# EAGLE design ArbotixProv11 (EAGLE 7.2.0)

## Sheet 1 of 7: MAIN
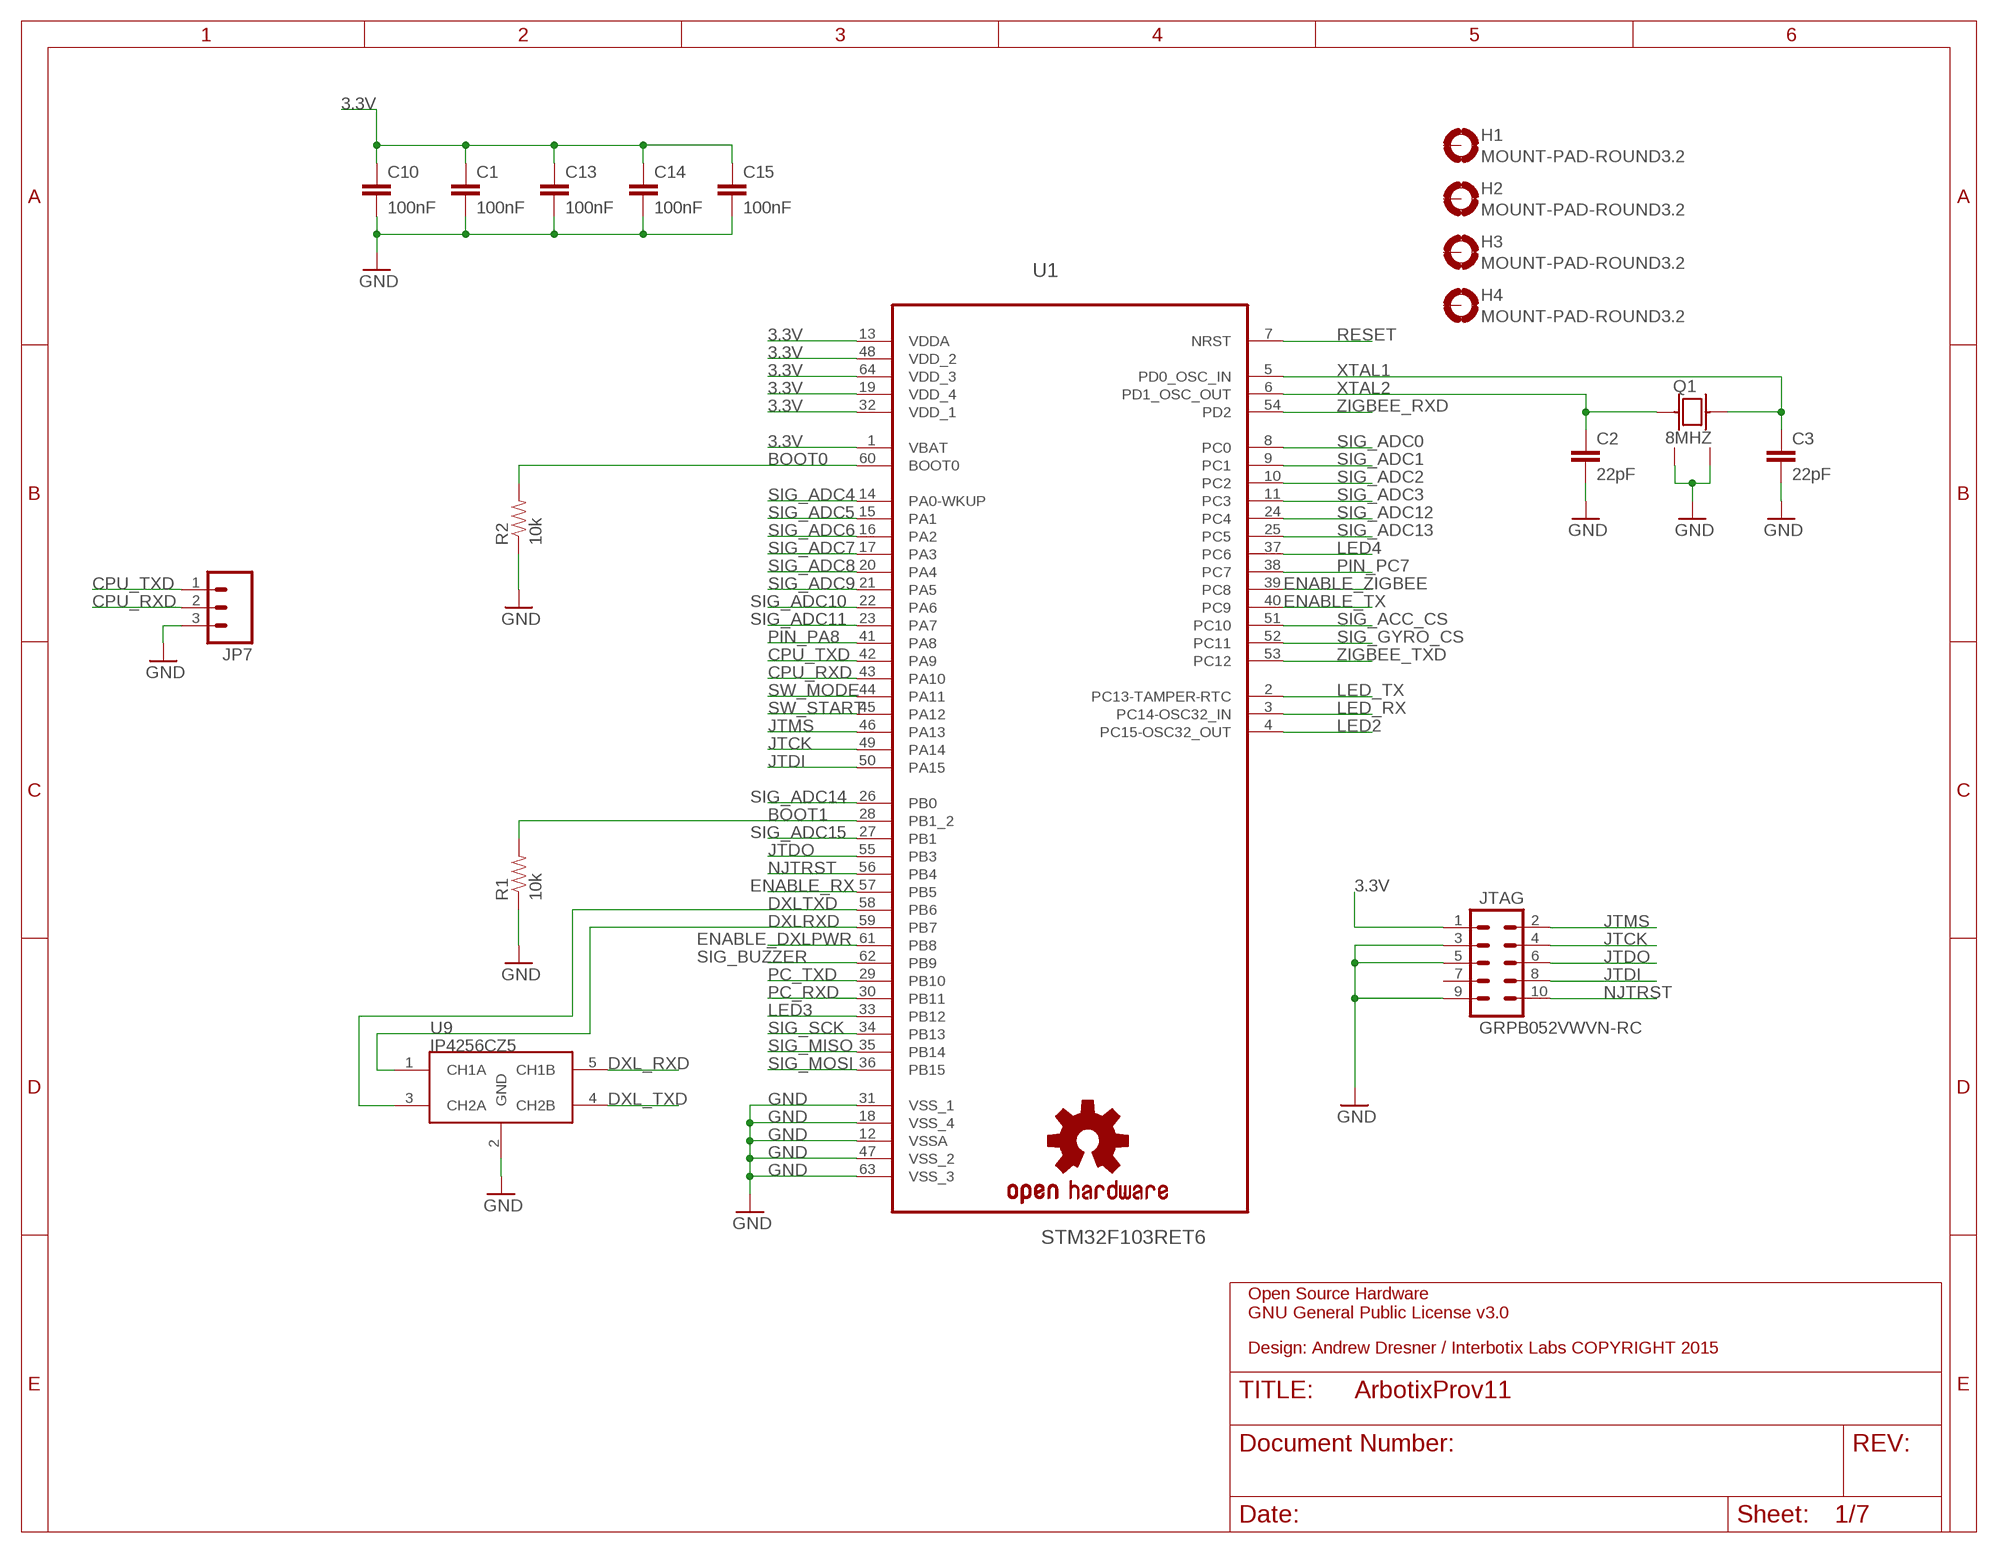
[diagram p0: schematic, sheet 1]

### Parts
C1  100nF  CAP0603-CAP  [0603-CAP]
C2  22pF  22PF-50V-5%(0603)  [0603-CAP]
C3  22pF  22PF-50V-5%(0603)  [0603-CAP]
C10  100nF  CAP0603-CAP  [0603-CAP]
C13  100nF  CAP0603-CAP  [0603-CAP]
C14  100nF  CAP0603-CAP  [0603-CAP]
C15  100nF  CAP0603-CAP  [0603-CAP]
H1  MOUNT-PAD-ROUND3.2  [3,2-PAD]
H2  MOUNT-PAD-ROUND3.2  [3,2-PAD]
H3  MOUNT-PAD-ROUND3.2  [3,2-PAD]
H4  MOUNT-PAD-ROUND3.2  [3,2-PAD]
JP7  M03PTH  [1X03]
JTAG  GRPB052VWVN-RC  M05X20.05_IN_PTH_SILK  [2X5_PTH_SILK_.05]
LOGO1  OSHW-LOGOM  [OSHW-LOGO-M]
Q1  8MHZ  AMB3B-25.000MHZ-B2-T8MHZ8MHZ  [4LCC]
R1  10k  RESISTOR0603-RES  [0603-RES]
R2  10k  RESISTOR0603-RES  [0603-RES]
U1  STM32F103RET6  [QFP50P1200X1200X160-64N]
U9  IP4256CZ5  IP4256CZ5-W,115  [SOT665]

### Nets
3.3V: C1.1 C10.1 C13.1 C14.1 C15.1 JTAG.1 U1.1(VBAT) U1.13(VDDA) U1.19(VDD_4) U1.32(VDD_1) U1.48(VDD_2) U1.64(VDD_3) ; also sheet 2,4,5,6,7
BOOT0: R2.2 U1.60(BOOT0)
BOOT1: R1.2 U1.28(PB1_2)
CPU_RXD: JP7.2 U1.43(PA10)
CPU_TXD: JP7.1 U1.42(PA9)
DXL_RXD: U9.5(CH1B) ; also sheet 3
DXL_TXD: U9.4(CH2B) ; also sheet 3
DXLRXD: U1.59(PB7) U9.1(CH1A)
DXLTXD: U1.58(PB6) U9.3(CH2A)
ENABLE_DXLPWR: U1.61(PB8) ; also sheet 3
ENABLE_RX: U1.57(PB5) ; also sheet 3
ENABLE_TX: U1.40(PC9) ; also sheet 3
ENABLE_ZIGBEE: U1.39(PC8) ; also sheet 7
GND: C1.2 C2.2 C3.2 C10.2 C13.2 C14.2 C15.2 JP7.3 JTAG.3 JTAG.5 JTAG.9 Q1.2(G$1) Q1.4(G$2) R1.1 R2.1 U1.12(VSSA) U1.18(VSS_4) U1.31(VSS_1) U1.47(VSS_2) U1.63(VSS_3) U9.2(GND) ; also sheet 2,3,4,5,6,7
JTCK: JTAG.4 U1.49(PA14)
JTDI: JTAG.8 U1.50(PA15)
JTDO: JTAG.6 U1.55(PB3)
JTMS: JTAG.2 U1.46(PA13)
LED2: U1.4(PC15-OSC32_OUT) ; also sheet 6
LED3: U1.33(PB12) ; also sheet 6
LED4: U1.37(PC6) ; also sheet 6
LED_RX: U1.3(PC14-OSC32_IN) ; also sheet 6
LED_TX: U1.2(PC13-TAMPER-RTC) ; also sheet 6
NJTRST: JTAG.10 U1.56(PB4)
PC_RXD: U1.30(PB11) ; also sheet 4
PC_TXD: U1.29(PB10) ; also sheet 4
PIN_PA8: U1.41(PA8) ; also sheet 6
PIN_PC7: U1.38(PC7)
RESET: U1.7(NRST) ; also sheet 6
SIG_ACC_CS: U1.51(PC10) ; also sheet 5
SIG_ADC0: U1.8(PC0) ; also sheet 6
SIG_ADC1: U1.9(PC1) ; also sheet 6
SIG_ADC2: U1.10(PC2) ; also sheet 6
SIG_ADC3: U1.11(PC3) ; also sheet 6
SIG_ADC4: U1.14(PA0-WKUP) ; also sheet 6
SIG_ADC5: U1.15(PA1) ; also sheet 6
SIG_ADC6: U1.16(PA2) ; also sheet 6
SIG_ADC7: U1.17(PA3) ; also sheet 6
SIG_ADC8: U1.20(PA4) ; also sheet 6
SIG_ADC9: U1.21(PA5) ; also sheet 6
SIG_ADC10: U1.22(PA6) ; also sheet 6
SIG_ADC11: U1.23(PA7) ; also sheet 6
SIG_ADC12: U1.24(PC4) ; also sheet 6
SIG_ADC13: U1.25(PC5) ; also sheet 6
SIG_ADC14: U1.26(PB0) ; also sheet 6
SIG_ADC15: U1.27(PB1) ; also sheet 6
SIG_BUZZER: U1.62(PB9) ; also sheet 6
SIG_GYRO_CS: U1.52(PC11) ; also sheet 5
SIG_MISO: U1.35(PB14) ; also sheet 5
SIG_MOSI: U1.36(PB15) ; also sheet 5
SIG_SCK: U1.34(PB13) ; also sheet 5
SW_MODE: U1.44(PA11) ; also sheet 6
SW_START: U1.45(PA12) ; also sheet 6
XTAL1: C3.1 Q1.3 U1.5(PD0_OSC_IN)
XTAL2: C2.1 Q1.1 U1.6(PD1_OSC_OUT)
ZIGBEE_RXD: U1.54(PD2) ; also sheet 7
ZIGBEE_TXD: U1.53(PC12) ; also sheet 7
Unconnected: H1.B3,2(MOUNT) H2.B3,2(MOUNT) H3.B3,2(MOUNT) H4.B3,2(MOUNT) JTAG.7

### Notes on the sheet
- Open Source Hardware
  GNU General Public License v3.0
- Design: Andrew Dresner / Interbotix Labs COPYRIGHT 2015

## Sheet 2 of 7: Power
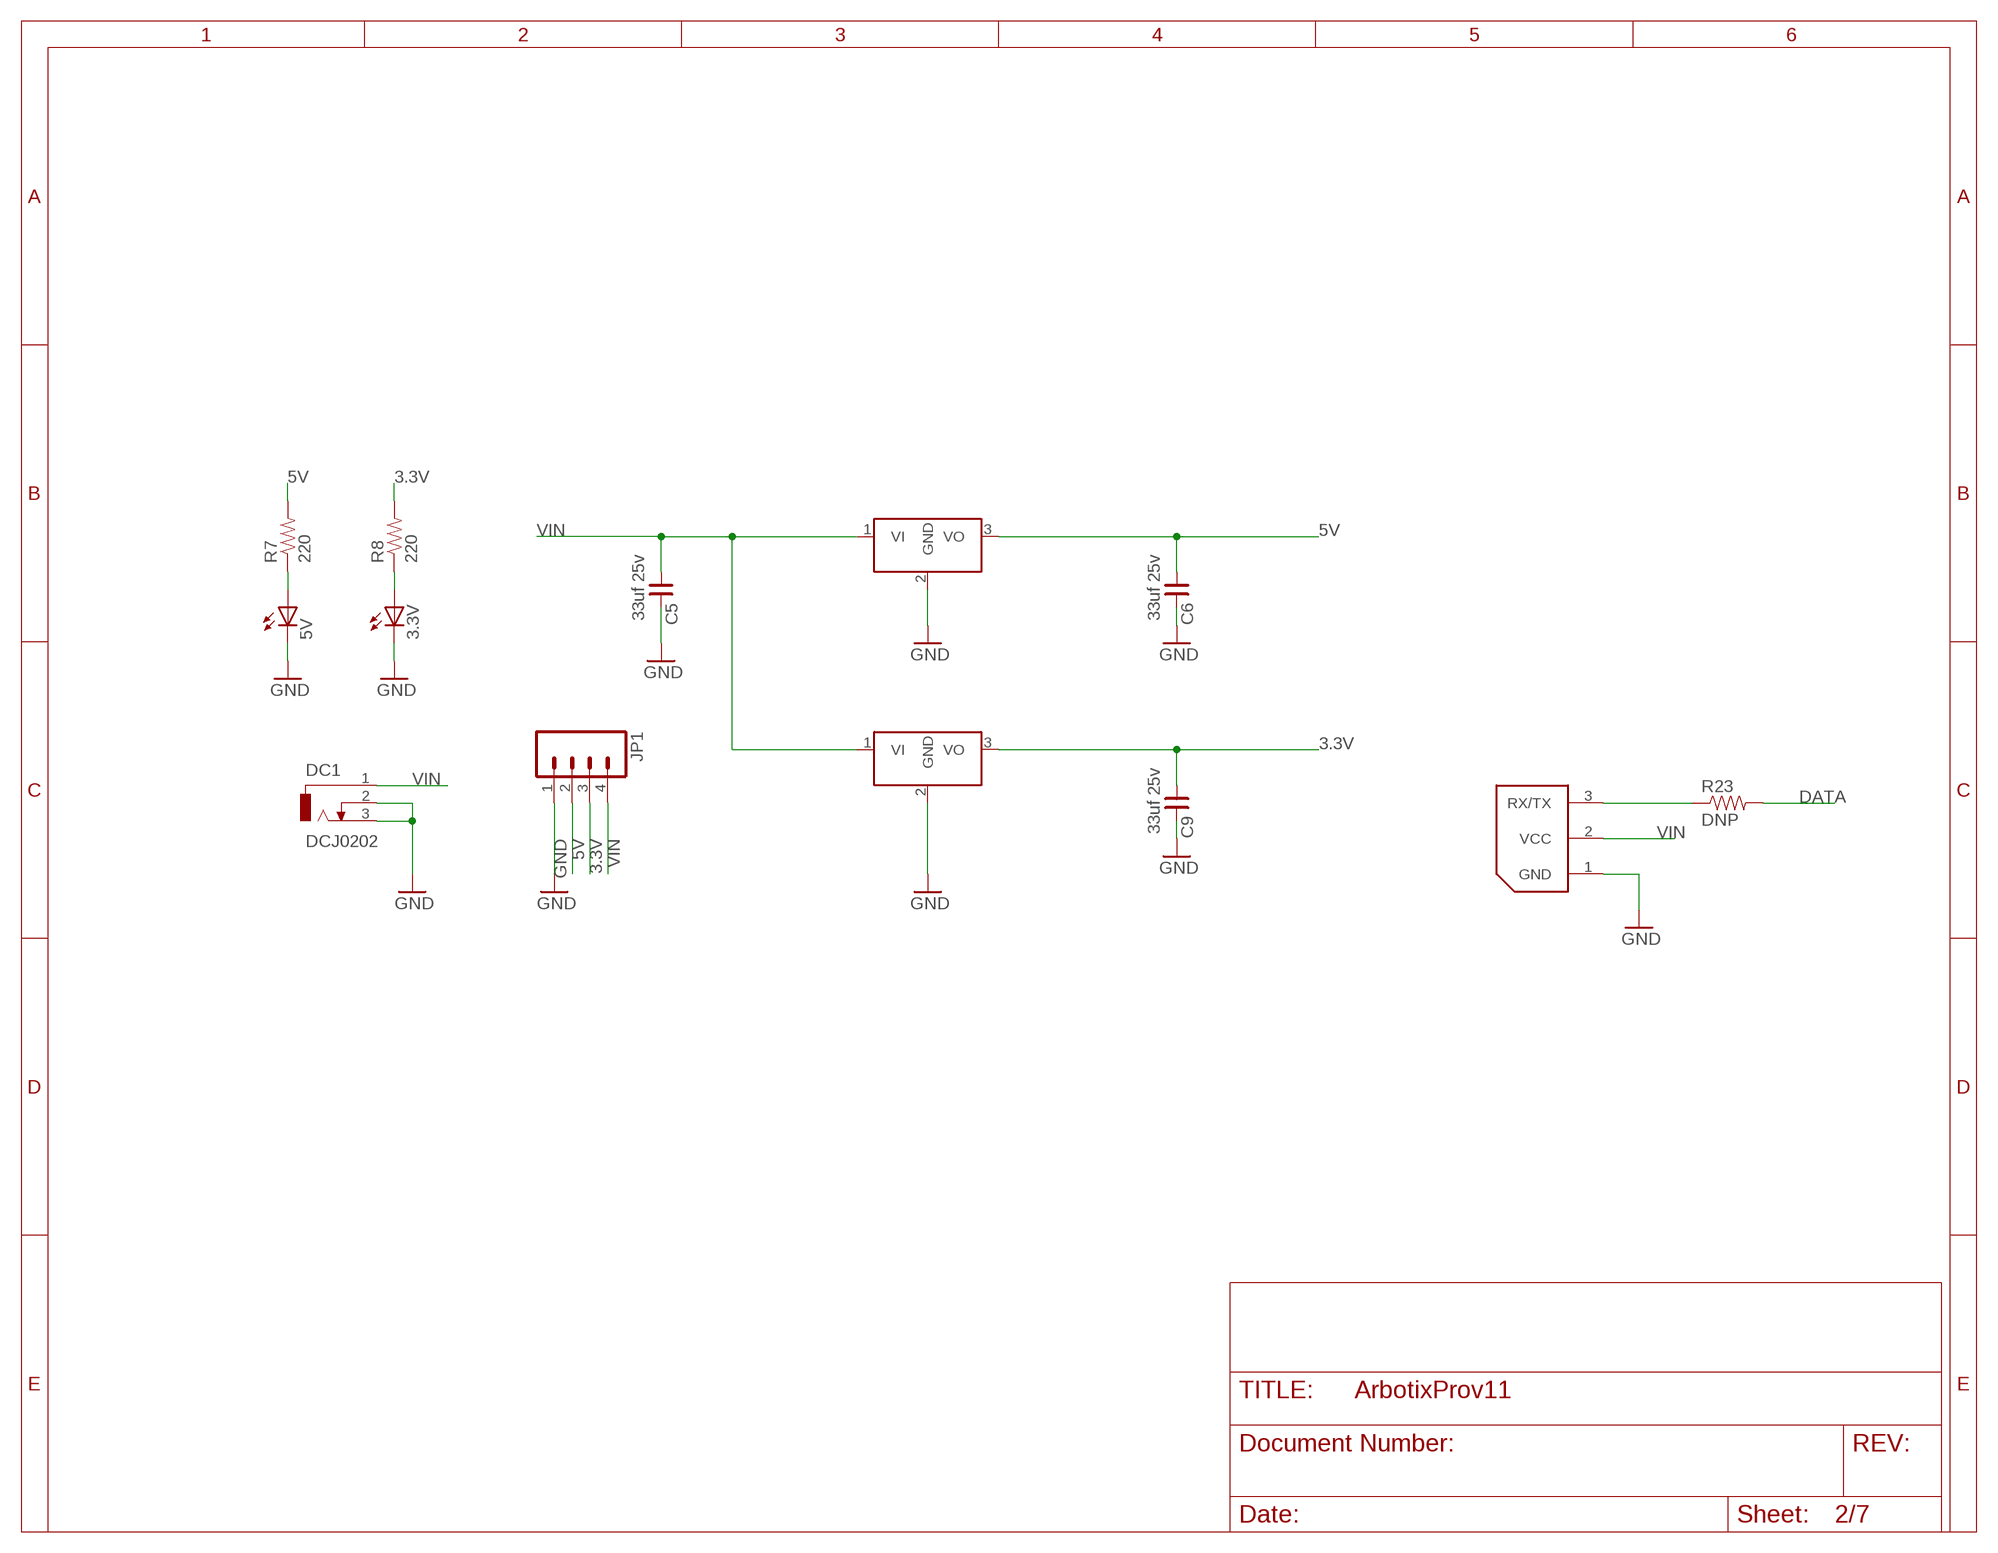
[diagram p1: schematic, sheet 2]

### Parts
3.3V  LEDCHIPLED_0603  [CHIPLED_0603]
3V3REG  DCDC_OKI-78SR-3.3  DCDC_OKI-78SR  [OKI-78SRH]
5V  LEDCHIPLED_0603  [CHIPLED_0603]
5VREG  DCDC_OKI-78SR-5  DCDC_OKI-78SR  [OKI-78SRH]
C5  33uf 25v  CBP-SV-C  [SV-C]
C6  33uf 25v  CBP-SV-C  [SV-C]
C9  33uf 25v  CBP-SV-C  [SV-C]
CPU-POWER  WM18887-ND  [BIOLOID]
DC1  DCJ0202  [DCJ0202]
JP1  M04PTH  [1X04]
R7  220  RESISTOR0603  [0603-RES]
R8  220  RESISTOR0603  [0603-RES]
R23  DNP  RESISTOR0603  [0603-RES]

### Nets
3.3V: 3V3REG.3(VO) C9.+ JP1.3 R8.2 ; also sheet 1,4,5,6,7
5V: 5VREG.3(VO) C6.+ JP1.2 R7.2 ; also sheet 3,6
DATA: R23.2 ; also sheet 3
GND: 3.3V.C 3V3REG.2(GND) 5V.C 5VREG.2(GND) C5.- C6.- C9.- CPU-POWER.1(GND) DC1.2 DC1.3 JP1.1 ; also sheet 1,3,4,5,6,7
N$9: CPU-POWER.3(RX/TX) R23.1
N$12: 5V.A R7.1
N$14: 3.3V.A R8.1
VIN: 3V3REG.1(VI) 5VREG.1(VI) C5.+ CPU-POWER.2(VCC) DC1.1 JP1.4 ; also sheet 3,6

## Sheet 3 of 7: DXL BUS
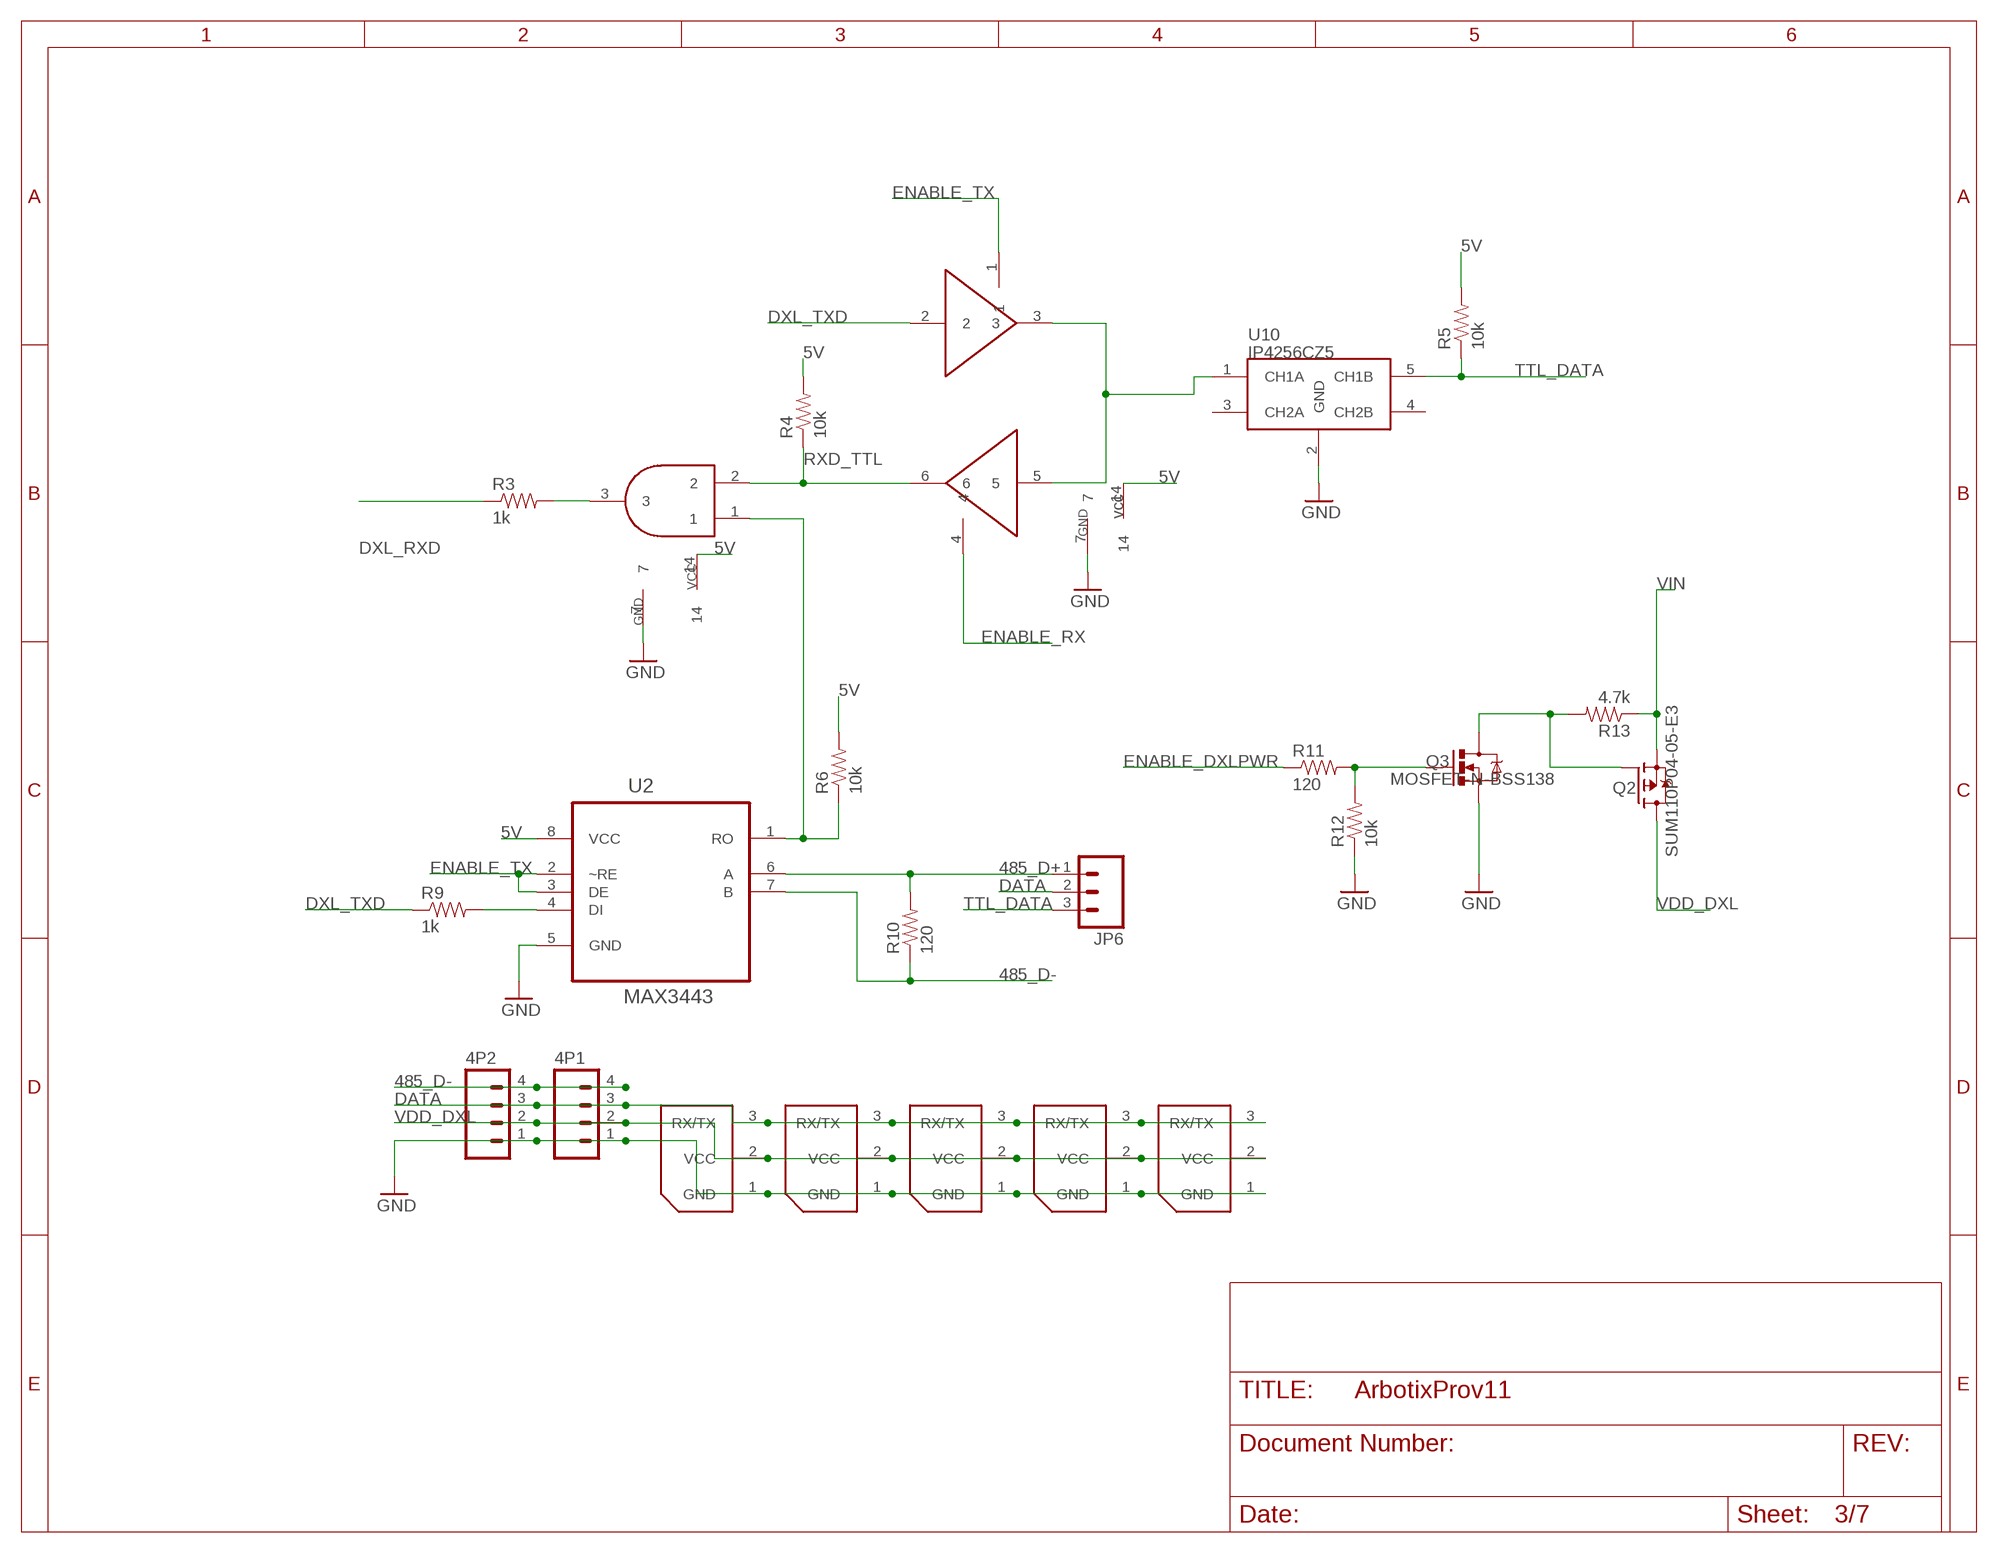
[diagram p2: schematic, sheet 3]

### Parts
3P1  WM18887-ND  [BIOLOID]
3P2  WM18887-ND  [BIOLOID]
3P3  WM18887-ND  [BIOLOID]
3P4  WM18887-ND  [BIOLOID]
3P5  WM18887-ND  [BIOLOID]
4P1  M04PTH  [1X04]
4P2  M04PTH  [1X04]
JP6  M03PTH  [1X03]
Q2  SUM110P04-05-E3  SPB80P06P  [TO263]
Q3  MOSFET-N-BSS138  MOSFET-NCHANNELBSS138  [SOT23]
R3  1k  RESISTOR0603-RES  [0603-RES]
R4  10k  RESISTOR0603-RES  [0603-RES]
R5  10k  RESISTOR0603-RES  [0603-RES]
R6  10k  RESISTOR0603-RES  [0603-RES]
R9  1k  RESISTOR0603-RES  [0603-RES]
R10  120  RESISTOR0603-RES  [0603-RES]
R11  120  RESISTOR0603-RES  [0603-RES]
R12  10k  RESISTOR0603-RES  [0603-RES]
R13  4.7k  RESISTOR0603-RES  [0603-RES]
U2  MAX3443  MAX3443EESA+  [SOIC127P600X175-8N]
U6  74HC08D,653  74HCT08D,653  [14-SOIC]
U7  74HC126D,653  [14-SOIC]
U10  IP4256CZ5  IP4256CZ5-W,115  [SOT665]

### Nets
5V: R4.2 R5.2 R6.2 U2.8(VCC) U6.14 U7.14 ; also sheet 2,6
485_D+: JP6.1 R10.2 U2.6(A)
485_D-: 4P1.4 4P2.4 R10.1 U2.7(B)
DATA: 3P1.3(RX/TX) 3P2.3(RX/TX) 3P3.3(RX/TX) 3P4.3(RX/TX) 3P5.3(RX/TX) 4P1.3 4P2.3 JP6.2 ; also sheet 2
DXL_RXD: R3.1 ; also sheet 1
DXL_TXD: R9.1 U7.2 ; also sheet 1
ENABLE_DXLPWR: R11.1 ; also sheet 1
ENABLE_RX: U7.4 ; also sheet 1
ENABLE_TX: U2.2(~RE) U2.3(DE) U7.1 ; also sheet 1
GND: 3P1.1(GND) 3P2.1(GND) 3P3.1(GND) 3P4.1(GND) 3P5.1(GND) 4P1.1 4P2.1 Q3.2(S) R12.1 U2.5(GND) U6.7 U7.7 U10.2(GND) ; also sheet 1,2,4,5,6,7
N$1: Q3.1(G) R11.2 R12.2
N$5: R3.2 U6.3
N$6: R9.2 U2.4(DI)
N$7: R6.1 U2.1(RO) U6.1
N$15: Q2.1(G) Q3.3(D) R13.2
N$17: U7.3 U7.5 U10.1(CH1A)
RXD_TTL: R4.1 U6.2 U7.6
TTL_DATA: JP6.3 R5.1 U10.5(CH1B)
VDD_DXL: 3P1.2(VCC) 3P2.2(VCC) 3P3.2(VCC) 3P4.2(VCC) 3P5.2(VCC) 4P1.2 4P2.2 Q2.3(D)
VIN: Q2.2(S) R13.1 ; also sheet 2,6
Unconnected: U10.3(CH2A) U10.4(CH2B)

## Sheet 4 of 7: USB-FTDI-TERMINAL
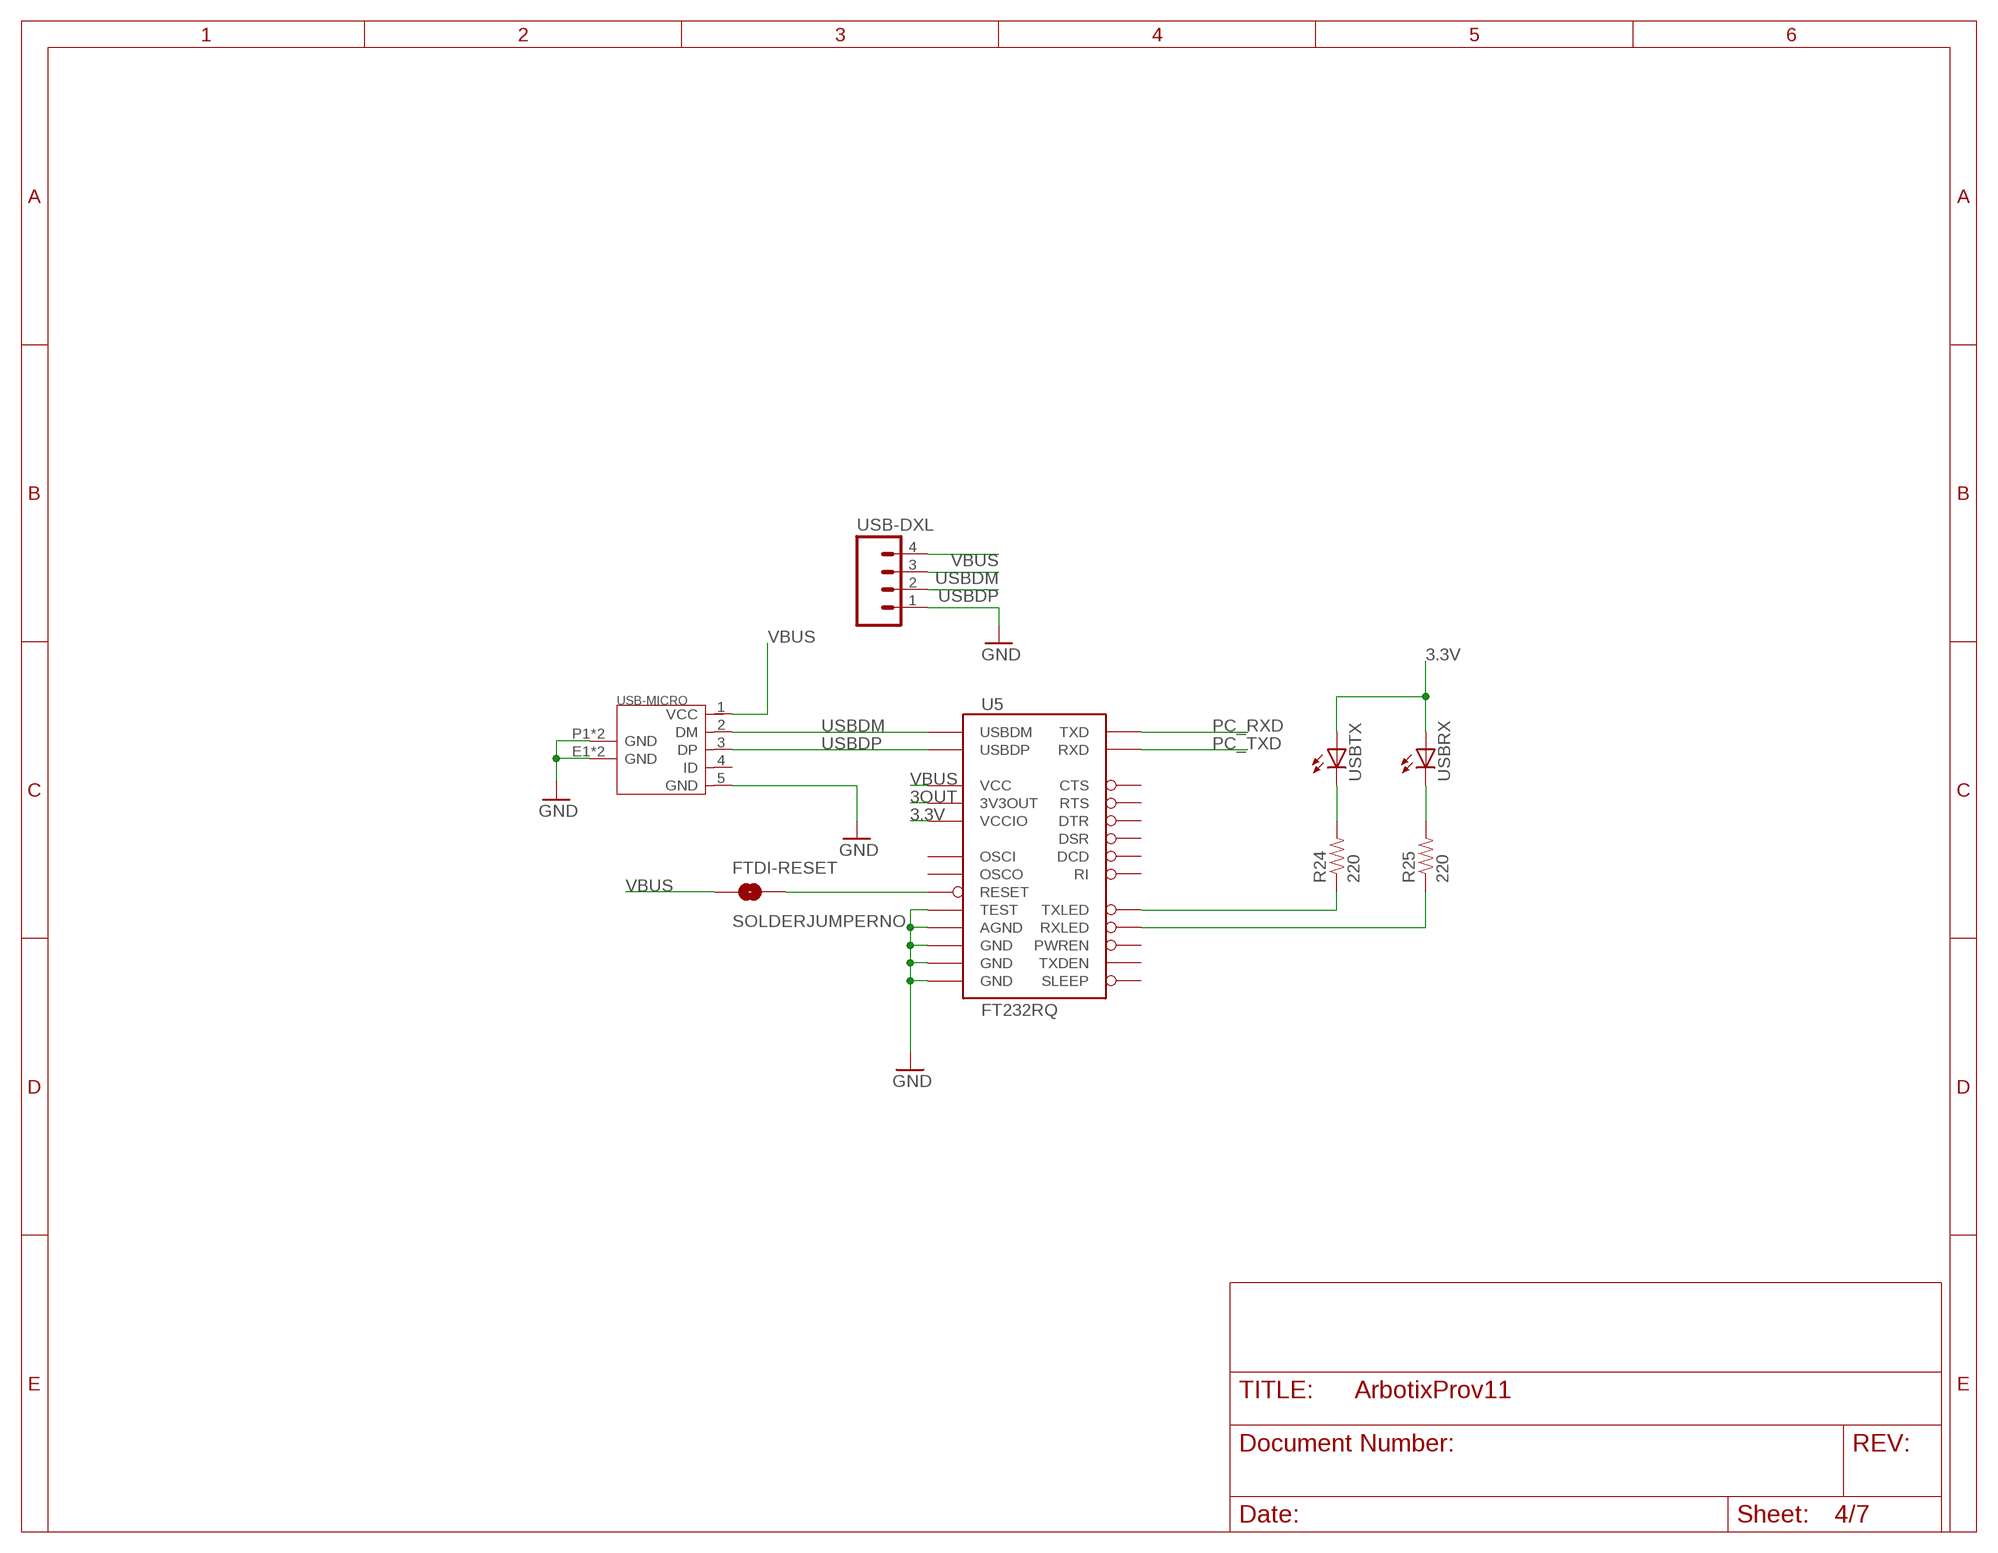
[diagram p3: schematic, sheet 4]

### Parts
FTDI-RESET  SOLDERJUMPERNO  [SJ_2S-NO]
R24  220  RESISTOR0603  [0603-RES]
R25  220  RESISTOR0603  [0603-RES]
U5  FT232RQ  [QFN-32]
USB-DXL  M04PTH  [1X04]
USB-MICRO  MICRO-USB-5P-340015001  [B-SMD-5P]
USBRX  LEDCHIPLED_0603  [CHIPLED_0603]
USBTX  LEDCHIPLED_0603  [CHIPLED_0603]

### Nets
3.3V: U5.1(VCCIO) USBRX.A USBTX.A ; also sheet 1,2,5,6,7
3OUT: U5.16(3V3OUT)
GND: U5.4(GND) U5.17(GND) U5.20(GND) U5.24(AGND) U5.26(TEST) USB-DXL.1 USB-MICRO.5(GND) USB-MICRO.E1(GND) USB-MICRO.E2(GND) USB-MICRO.P1(GND) USB-MICRO.P2(GND) ; also sheet 1,2,3,5,6,7
N$3: FTDI-RESET.2 U5.18(RESET)
N$19: R24.2 USBTX.C
N$22: R25.2 USBRX.C
N$24: R24.1 U5.22(TXLED)
N$25: R25.1 U5.21(RXLED)
PC_RXD: U5.30(TXD) ; also sheet 1
PC_TXD: U5.2(RXD) ; also sheet 1
USBDM: U5.15(USBDM) USB-DXL.3 USB-MICRO.2(DM)
USBDP: U5.14(USBDP) USB-DXL.2 USB-MICRO.3(DP)
VBUS: FTDI-RESET.1 U5.19(VCC) USB-DXL.4 USB-MICRO.1(VCC)
Unconnected: U5.3(RI) U5.6(DSR) U5.7(DCD) U5.8(CTS) U5.9(SLEEP) U5.10(TXDEN) U5.11(PWREN) U5.27(OSCI) U5.28(OSCO) U5.31(DTR) U5.32(RTS) USB-MICRO.4(ID)

## Sheet 5 of 7: ACC/GYRO
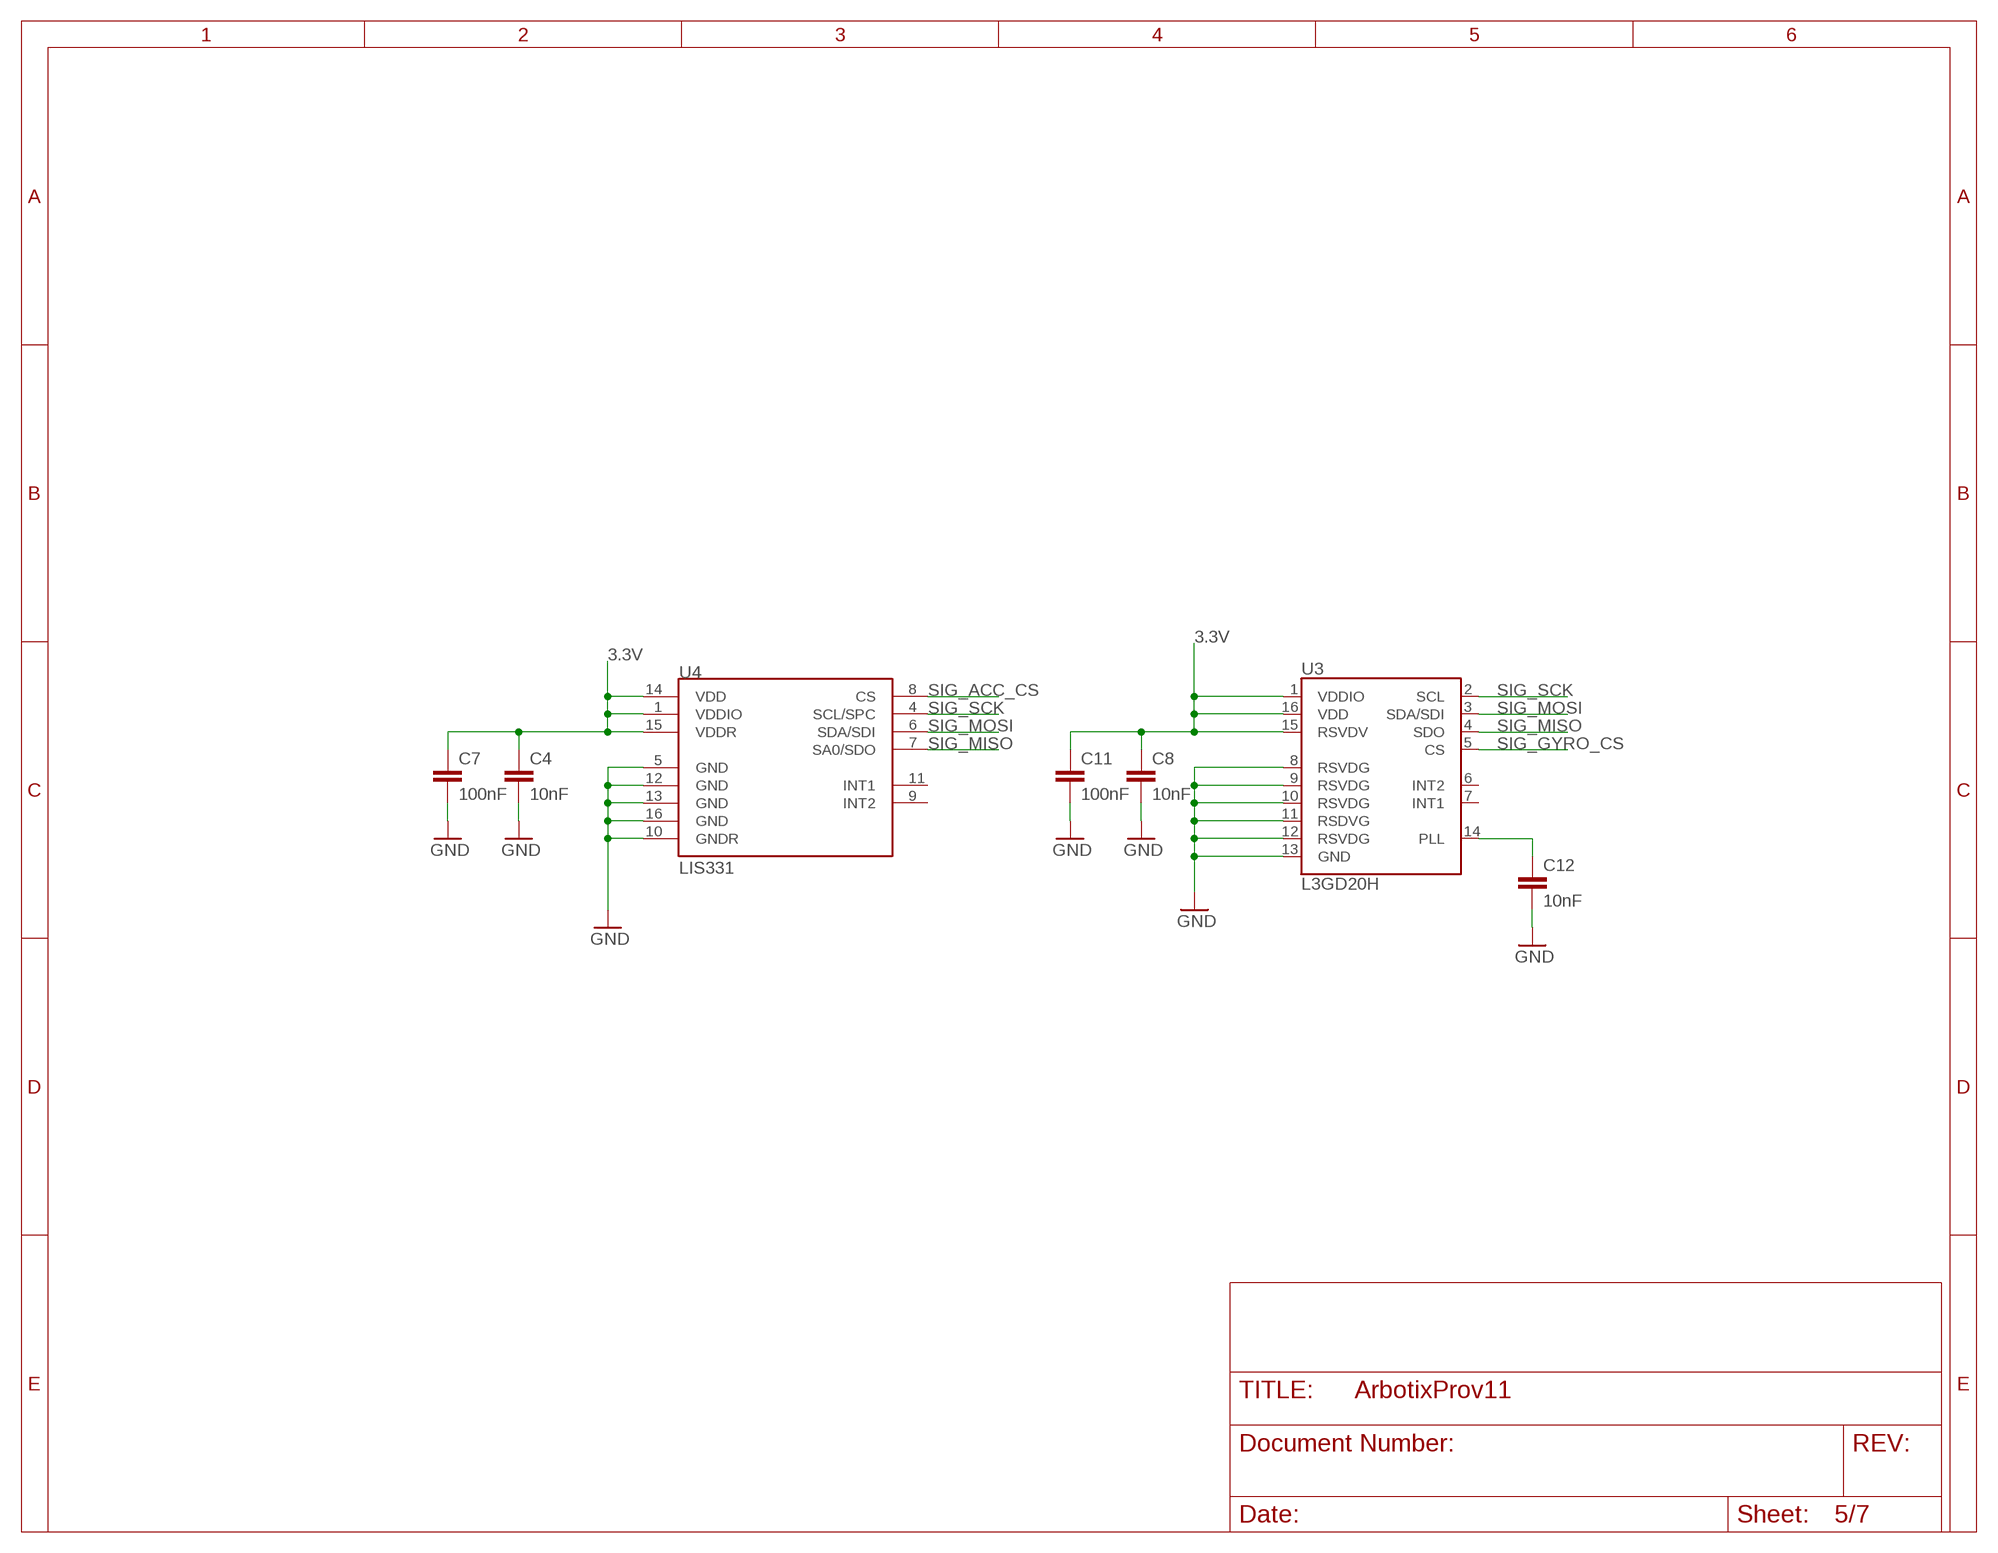
[diagram p4: schematic, sheet 5]

### Parts
C4  10nF  CAP0603-CAP  [0603-CAP]
C7  100nF  CAP0603-CAP  [0603-CAP]
C8  10nF  CAP0603-CAP  [0603-CAP]
C11  100nF  CAP0603-CAP  [0603-CAP]
C12  10nF  CAP0603-CAP  [0603-CAP]
U3  L3GD20H  [LGA16-3MM]
U4  LIS331  [LGA16-3MM]

### Nets
3.3V: C4.1 C7.1 C8.1 C11.1 U3.1(VDDIO) U3.15(RSVDV) U3.16(VDD) U4.1(VDDIO) U4.14(VDD) U4.15(VDDR) ; also sheet 1,2,4,6,7
GND: C4.2 C7.2 C8.2 C11.2 C12.2 U3.8(RSVDG) U3.9(RSVDG) U3.10(RSVDG) U3.11(RSDVG) U3.12(RSVDG) U3.13(GND) U4.5(GND) U4.10(GNDR) U4.12(GND) U4.13(GND) U4.16(GND) ; also sheet 1,2,3,4,6,7
N$2: C12.1 U3.14(PLL)
SIG_ACC_CS: U4.8(CS) ; also sheet 1
SIG_GYRO_CS: U3.5(CS) ; also sheet 1
SIG_MISO: U3.4(SDO) U4.7(SA0/SDO) ; also sheet 1
SIG_MOSI: U3.3(SDA/SDI) U4.6(SDA/SDI) ; also sheet 1
SIG_SCK: U3.2(SCL) U4.4(SCL/SPC) ; also sheet 1
Unconnected: U3.6(INT2) U3.7(INT1) U4.9(INT2) U4.11(INT1)

## Sheet 6 of 7: IO
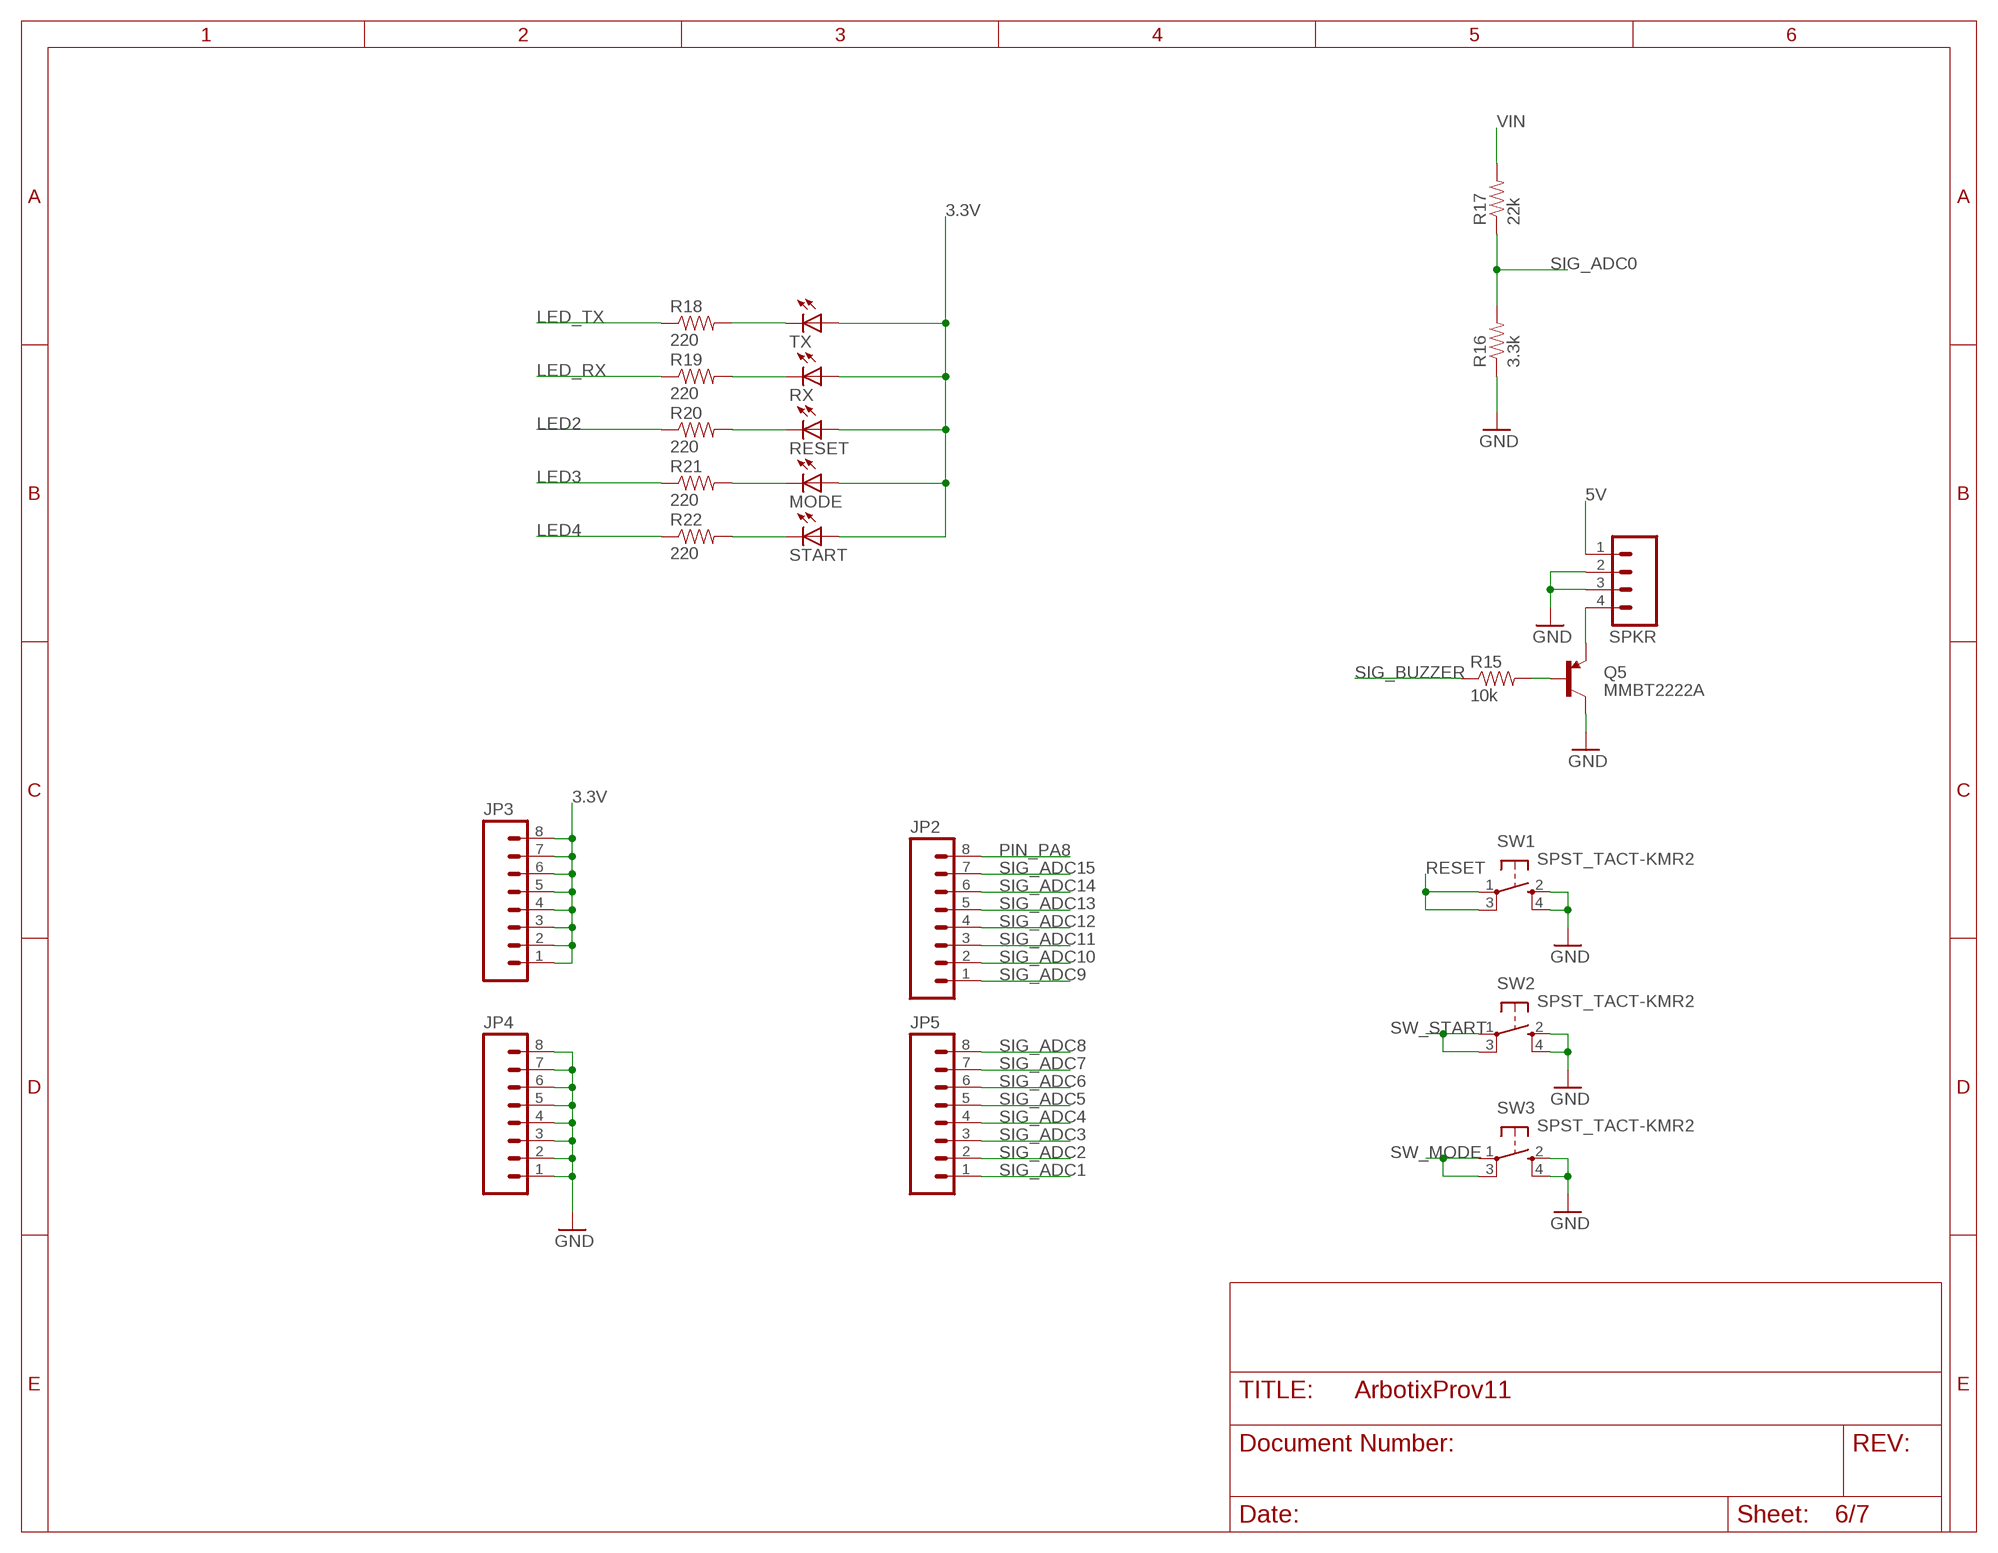
[diagram p5: schematic, sheet 6]

### Parts
JP2  M08SILK_FEMALE_PTH  [1X08]
JP3  M08SILK_FEMALE_PTH  [1X08]
JP4  M08SILK_FEMALE_PTH  [1X08]
JP5  M08SILK_FEMALE_PTH  [1X08]
MODE  LEDCHIP-LED0603  [CHIP-LED0603]
Q5  MMBT2222A  TRANSISTOR_PNPMMBT4403  [SOT23]
R15  10k  RESISTOR0603-RES  [0603-RES]
R16  3.3k  RESISTOR0603-RES  [0603-RES]
R17  22k  RESISTOR0603-RES  [0603-RES]
R18  220  RESISTOR0603-RES  [0603-RES]
R19  220  RESISTOR0603-RES  [0603-RES]
R20  220  RESISTOR0603-RES  [0603-RES]
R21  220  RESISTOR0603-RES  [0603-RES]
R22  220  RESISTOR0603-RES  [0603-RES]
RESET  LEDCHIP-LED0603  [CHIP-LED0603]
RX  LEDCHIP-LED0603  [CHIP-LED0603]
SPKR  M04PTH  [1X04]
START  LEDCHIP-LED0603  [CHIP-LED0603]
SW1  SPST_TACT-KMR2  [KMR2]
SW2  SPST_TACT-KMR2  [KMR2]
SW3  SPST_TACT-KMR2  [KMR2]
TX  LEDCHIP-LED0603  [CHIP-LED0603]

### Nets
3.3V: JP3.1 JP3.2 JP3.3 JP3.4 JP3.5 JP3.6 JP3.7 JP3.8 MODE.A RESET.A RX.A START.A TX.A ; also sheet 1,2,4,5,7
5V: SPKR.1 ; also sheet 2,3
GND: JP4.1 JP4.2 JP4.3 JP4.4 JP4.5 JP4.6 JP4.7 JP4.8 Q5.3(C) R16.1 SPKR.2 SPKR.3 SW1.2(S) SW1.4(S1) SW2.2(S) SW2.4(S1) SW3.2(S) SW3.4(S1) ; also sheet 1,2,3,4,5,7
LED2: R20.1 ; also sheet 1
LED3: R21.1 ; also sheet 1
LED4: R22.1 ; also sheet 1
LED_RX: R19.1 ; also sheet 1
LED_TX: R18.1 ; also sheet 1
N$8: R18.2 TX.C
N$11: R19.2 RX.C
N$13: Q5.1(B) R15.2
N$16: Q5.2(E) SPKR.4
N$20: R20.2 RESET.C
N$21: MODE.C R21.2
N$23: R22.2 START.C
PIN_PA8: JP2.8 ; also sheet 1
RESET: SW1.1(P) SW1.3(P1) ; also sheet 1
SIG_ADC0: R16.2 R17.1 ; also sheet 1
SIG_ADC1: JP5.1 ; also sheet 1
SIG_ADC2: JP5.2 ; also sheet 1
SIG_ADC3: JP5.3 ; also sheet 1
SIG_ADC4: JP5.4 ; also sheet 1
SIG_ADC5: JP5.5 ; also sheet 1
SIG_ADC6: JP5.6 ; also sheet 1
SIG_ADC7: JP5.7 ; also sheet 1
SIG_ADC8: JP5.8 ; also sheet 1
SIG_ADC9: JP2.1 ; also sheet 1
SIG_ADC10: JP2.2 ; also sheet 1
SIG_ADC11: JP2.3 ; also sheet 1
SIG_ADC12: JP2.4 ; also sheet 1
SIG_ADC13: JP2.5 ; also sheet 1
SIG_ADC14: JP2.6 ; also sheet 1
SIG_ADC15: JP2.7 ; also sheet 1
SIG_BUZZER: R15.1 ; also sheet 1
SW_MODE: SW3.1(P) SW3.3(P1) ; also sheet 1
SW_START: SW2.1(P) SW2.3(P1) ; also sheet 1
VIN: R17.2 ; also sheet 2,3

## Sheet 7 of 7: Wireless
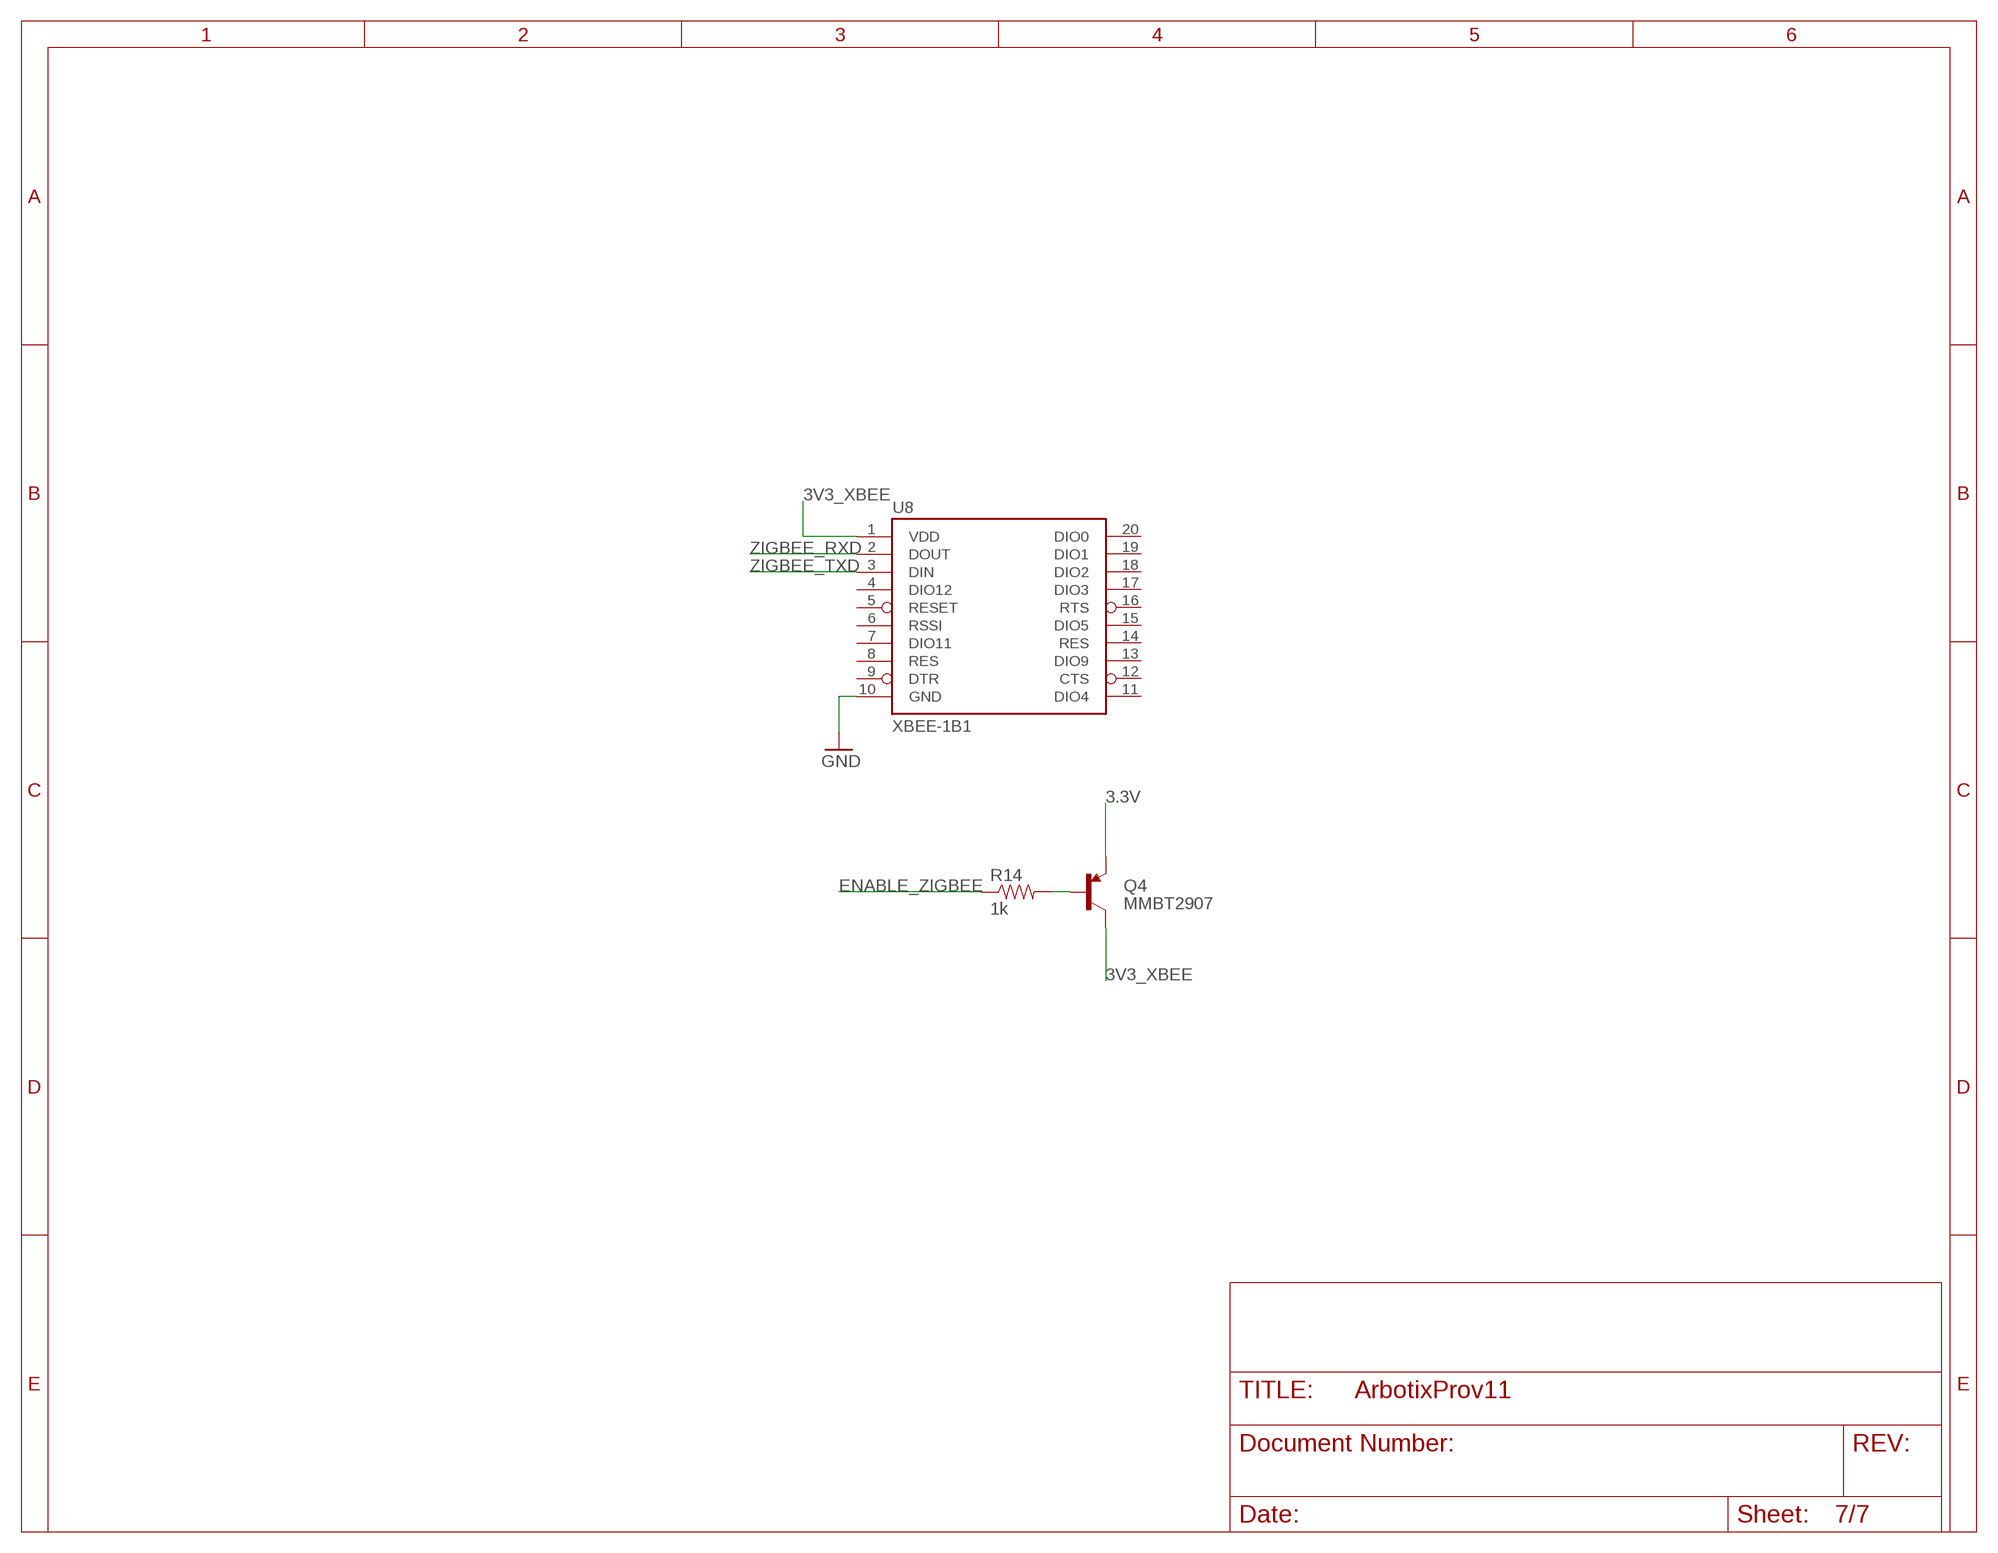
[diagram p6: schematic, sheet 7]

### Parts
Q4  MMBT2907  TRANSISTOR_PNPMMBT4403  [SOT23]
R14  1k  RESISTOR0603-RES  [0603-RES]
U8  XBEE-1B1  [XBEE-1]

### Nets
3.3V: Q4.2(E) ; also sheet 1,2,4,5,6
3V3_XBEE: Q4.3(C) U8.1(VDD)
ENABLE_ZIGBEE: R14.1 ; also sheet 1
GND: U8.10(GND) ; also sheet 1,2,3,4,5,6
N$18: Q4.1(B) R14.2
ZIGBEE_RXD: U8.2(DOUT) ; also sheet 1
ZIGBEE_TXD: U8.3(DIN) ; also sheet 1
Unconnected: U8.4(DIO12) U8.5(RESET) U8.6(RSSI) U8.7(DIO11) U8.8(RES) U8.9(DTR) U8.11(DIO4) U8.12(CTS) U8.13(DIO9) U8.14(RES) U8.15(DIO5) U8.16(RTS) U8.17(DIO3) U8.18(DIO2) U8.19(DIO1) U8.20(DIO0)

## Library data of the parts
3.3V 5V MODE RESET RX START TX USBRX USBTX = Interbotix:LED: LED OSRAM: - CHIPLED LG R971, LG N971, LY N971, LG Q971, LY Q971, LO R971, LY R971 LH N974, LH R974 LS Q976, LO Q976, LY Q976 LO Q996 - Hyper CHIPLED LW Q18S LB Q993, LB Q99A, LB R99A - SideLED LS A670, LO A670, LY A670, LG A670, LP A670 LB A673, LV A673, LT A673, LW A673 LH A674 LY A675 LS A676, LA A676, LO A676, LY A676, LW A676 LS A679, LY A679, LG A679 - Hyper Micro SIDELED® LS Y876, LA Y876, LO Y876, LY Y876 LT Y87S - SmartLED LW L88C, LW L88S LB L89C, LB L89S, LG L890 LS L89K, LO L89K, LY L89K LS L896, LA L896, LO L896, LY L896 - TOPLED LS T670, LO T670, LY T670, LG T670, LP T670 LSG T670, LSP T670, LSY T670, LOP T670, LYG T670 LG T671, LOG T671, LSG T671 LB T673, LV T673, LT T673, LW T673 LH T674 LS T676, LA T676, LO T676, LY T676, LB T676, LH T676, LSB T676, LW T676 LB T67C, LV T67C, LT T67C, LS T67K, LO T67K, LY T67K, LW E67C LS E67B, LA E67B, LO E67B, LY E67B, LB E67C, LV E67C, LT E67C LW T67C LS T679, LY T679, LG T679 LS T770, LO T770, LY T770, LG T770, LP T770 LB T773, LV T773, LT T773, LW T773 LH T774 LS E675, LA E675, LY E675, LS T675 LS T776, LA T776, LO T776, LY T776, LB T776 LHGB T686 LT T68C, LB T68C - Hyper Mini TOPLED® LB M676 - Mini TOPLED Santana® LG M470 LS M47K, LO M47K, LY M47K Source: http://www.osram.convergy.de/
3P1-3P5 CPU-POWER = robots:WM18887-ND: Bioloid Bus Header Digikey Part No: WM18887-ND Molex/Waldom Electronics Corp 22-03-5035
3V3REG 5VREG = carrilib:DCDC_OKI-78SR: 4.95W DC/DC Converter Manufacturer: Murata Part Number: OKI-78SR-5/1.5-W36H-C OKI-78SR-3.3/1.5-W36H-C
4P1 4P2 JP1 SPKR USB-DXL = SparkFun-Connectors:M04: Header 4 Standard 4-pin 0.1" header. Use with straight break away headers (SKU : PRT-00116), right angle break away headers (PRT-00553), swiss pins (PRT-00743), machine pins (PRT-00117), and female headers (PRT-00115). Molex polarized connector foot print use with SKU : PRT-08231 with associated crimp pins and housings. 1MM SMD Version SKU: PRT-10208
C1 C4 C7 C8 C10-C15 = SparkFun-Capacitors:CAP: Capacitor Standard 0603 ceramic capacitor, and 0.1" leaded capacitor.
C2 C3 = SparkFun-Capacitors:22PF-50V-5%(0603): CAP-07876; PROD_ID: CAP-07876
C5 C6 C9 = cap-master:CBP-: BIPOLAR CAP
DC1 = con-jack:DCJ0202: DC POWER JACK Source: DCJ0202.pdf; OC_FARNELL: unknown; OC_NEWARK: unknown
FTDI-RESET = SparkFun-Passives:SOLDERJUMPER: Solder Jumper Standard SMD solder jumper. Used to automate production. Two varients : Normally Open and Normally Closed are the same, but have different paste layers. NC will have a large amount of paste and should jumper during reflow.
H1-H4 = holes:MOUNT-PAD-ROUND: MOUNTING PAD, round
JP2-JP5 = SparkFun-Connectors:M08: Header 8 Standard 8-pin 0.1" header. Use with straight break away headers (SKU : PRT-00116), right angle break away headers (PRT-00553), swiss pins (PRT-00743), machine pins (PRT-00117), and female headers (PRT-00115).; PROD_ID: CONN-08438
JP6 JP7 = SparkFun-Connectors:M03: Header 3 Standard 3-pin 0.1" header. Use with straight break away headers (SKU : PRT-00116), right angle break away headers (PRT-00553), swiss pins (PRT-00743), machine pins (PRT-00117), and female headers (PRT-00115). Molex polarized connector foot print use with SKU : PRT-08232 with associated crimp pins and housings.
JTAG = SparkFun-Connectors:M05X2: Header 5x2 Standard 10-pin dual row 0.1" header. Commonly used with AVR-ISP. Use with Spark Fun Electronics SKU: PRT-00778
LOGO1 = SparkFun-Aesthetics:OSHW-LOGO: Open Source Hardware Logo This logo indicates the piece of hardware it is found on incorporates a OSHW license and/or adheres to the definition of open source hardware found here: http://freedomdefined.org/OSHW
Q1 = stm32f4:AMB3B-25.000MHZ-B2-T: CRYSTAL, 8.000MHZ 18PF SMD reviewed: YES tested: YES
Q2 = transistor-fet:SPB80P06P: SIPMOS (R) Power-Transistor P-Channel, Enhancement mode Source: http://www.infineon.com/upload/Document/cmc_upload/documents/011/3685/SPP80P06P.pdf
Q3 = SparkFun-DiscreteSemi:MOSFET-NCHANNEL: Common NMOSFET Parts MFG P/N Store ID Prod ID FDD8780 TRANS-09984 SI7820DN TRANS-11055 FDS6630A IC-08089 2N7002PW TRANS-11151 FQP30N06L COM-10213 TRANS-10060 BSS123LT1G TRANS-08345 BSS138 TRANS-00830 BS170 2N7000; PROD_ID: TRANS-00830
Q4 Q5 = SparkFun-DiscreteSemi:TRANSISTOR_PNP: Generic PNP BJT Double check pinouts against datasheets- not all devices are the same! MMBT3906 - 40V 200mA SOT-23 (TRANS-08052) MMBT4403 - 40V 600mA SOT-23 (TRANS-09245); PROD_ID: TRANS-09245; VALUE: MMBT4403
R1-R25 = SparkFun-Resistors:RESISTOR: Resistor Basic schematic elements and footprints for 0603, 1206, and PTH resistors.
SW1-SW3 = adafruit:SPST_TACT: SMT 6mm switch, EVQQ2 series http://www.ladyada.net/library/eagle
U1 = ST Microelctronics_By_element14_Batch_1:STM32F103RET6: ARM-based 32-bit MCU; MPN: STM32F103RET6; OC_FARNELL: 1624138; OC_NEWARK: 01P4101; PACKAGE: QFP-64; SUPPLIER: STMICROELECTRONICS
U2 = Maxim_By_element14_Batch_1:MAX3443EESA+: Transceivers; MPN: MAX3443EESA+; OC_FARNELL: 1593360; OC_NEWARK: 59J3022; PACKAGE: SOIC-8; SUPPLIER: Maxim
U3 = SparkFun-Sensors:L3GD20H
U4 = SparkFun-Sensors:LIS331: 3-axis 6/12/24g SPI/I2C accelerometer
U5 = SparkFun-DigitalIC:FT232RQ: USB to USART. Non-stock item, unproven FP for this part.
U6 = Interbotix:74HCT08D,653
U7 = Interbotix:74HC126D,653
U8 = SparkFun-RF:XBEE-1: Xbee module footprints
U9 U10 = ArbotixPro:IP4256CZ5-W,115
USB-MICRO = OPL Eagle Library:MICRO-USB-5P: ST-USB-001E：MICRO USB B SMD R/A

## Board
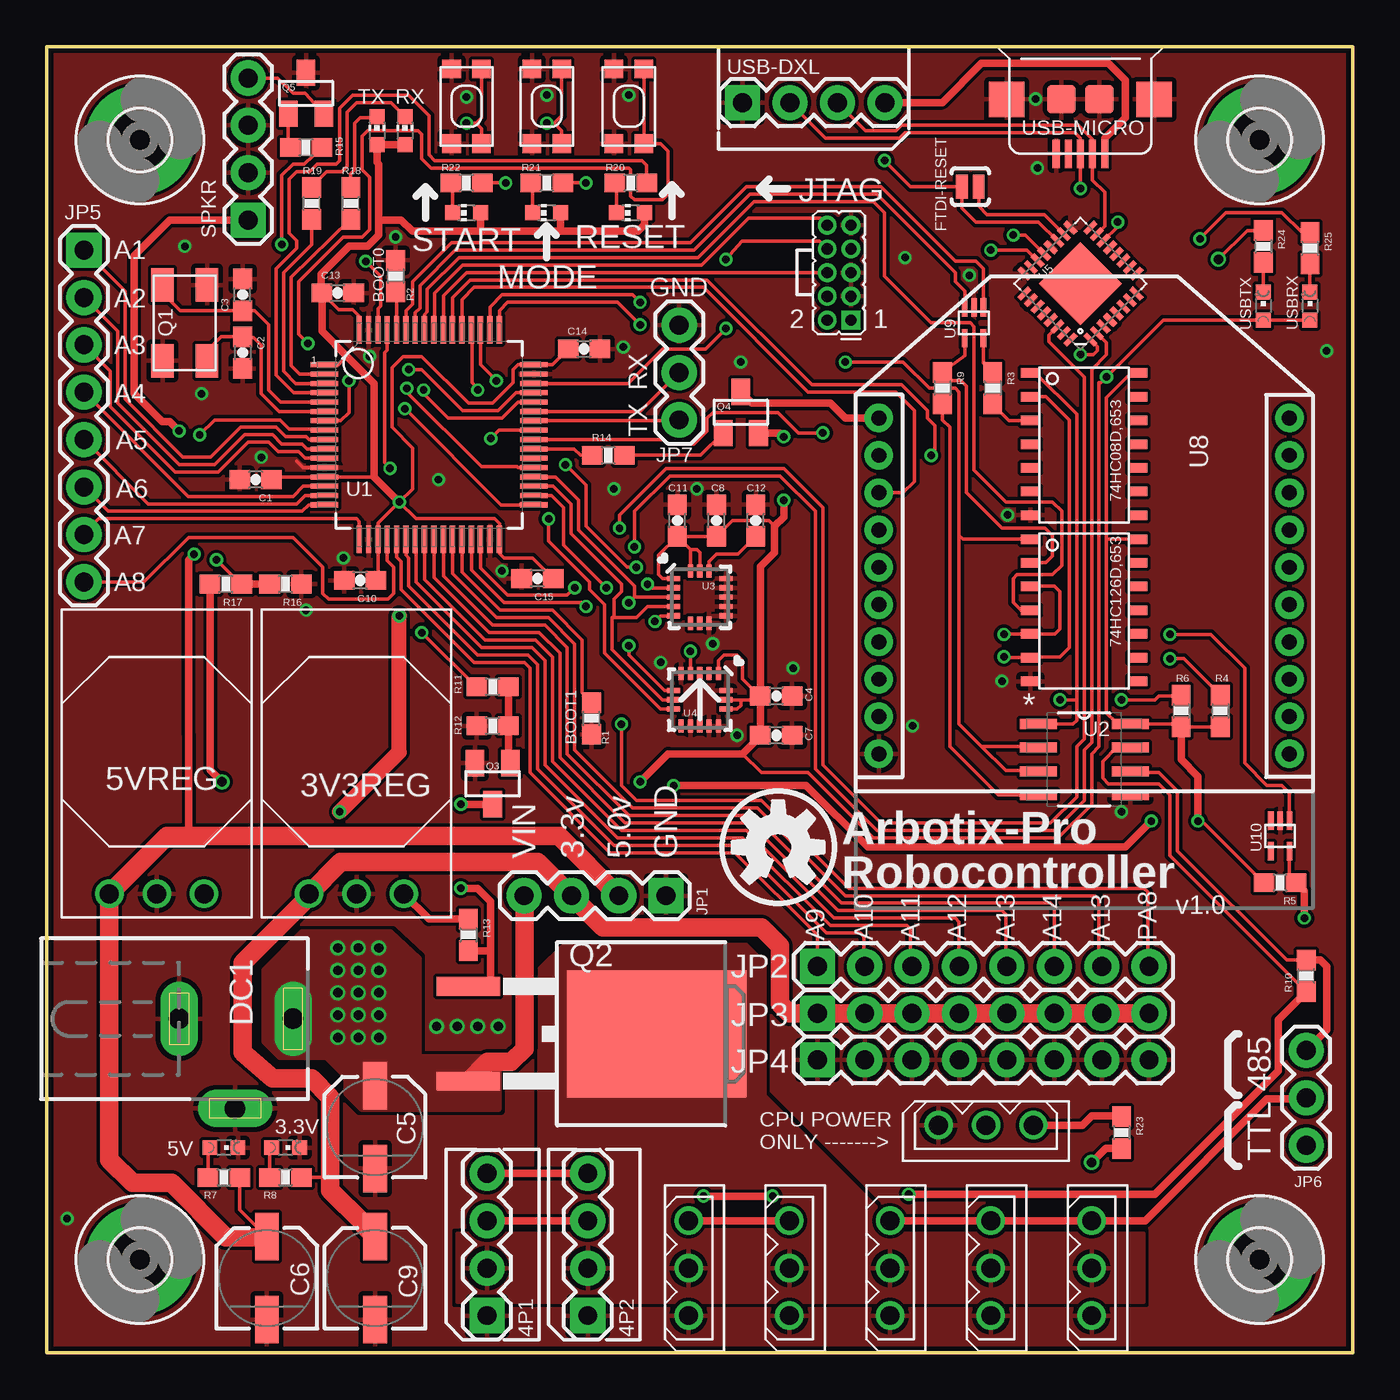
[diagram p7: board, top side]
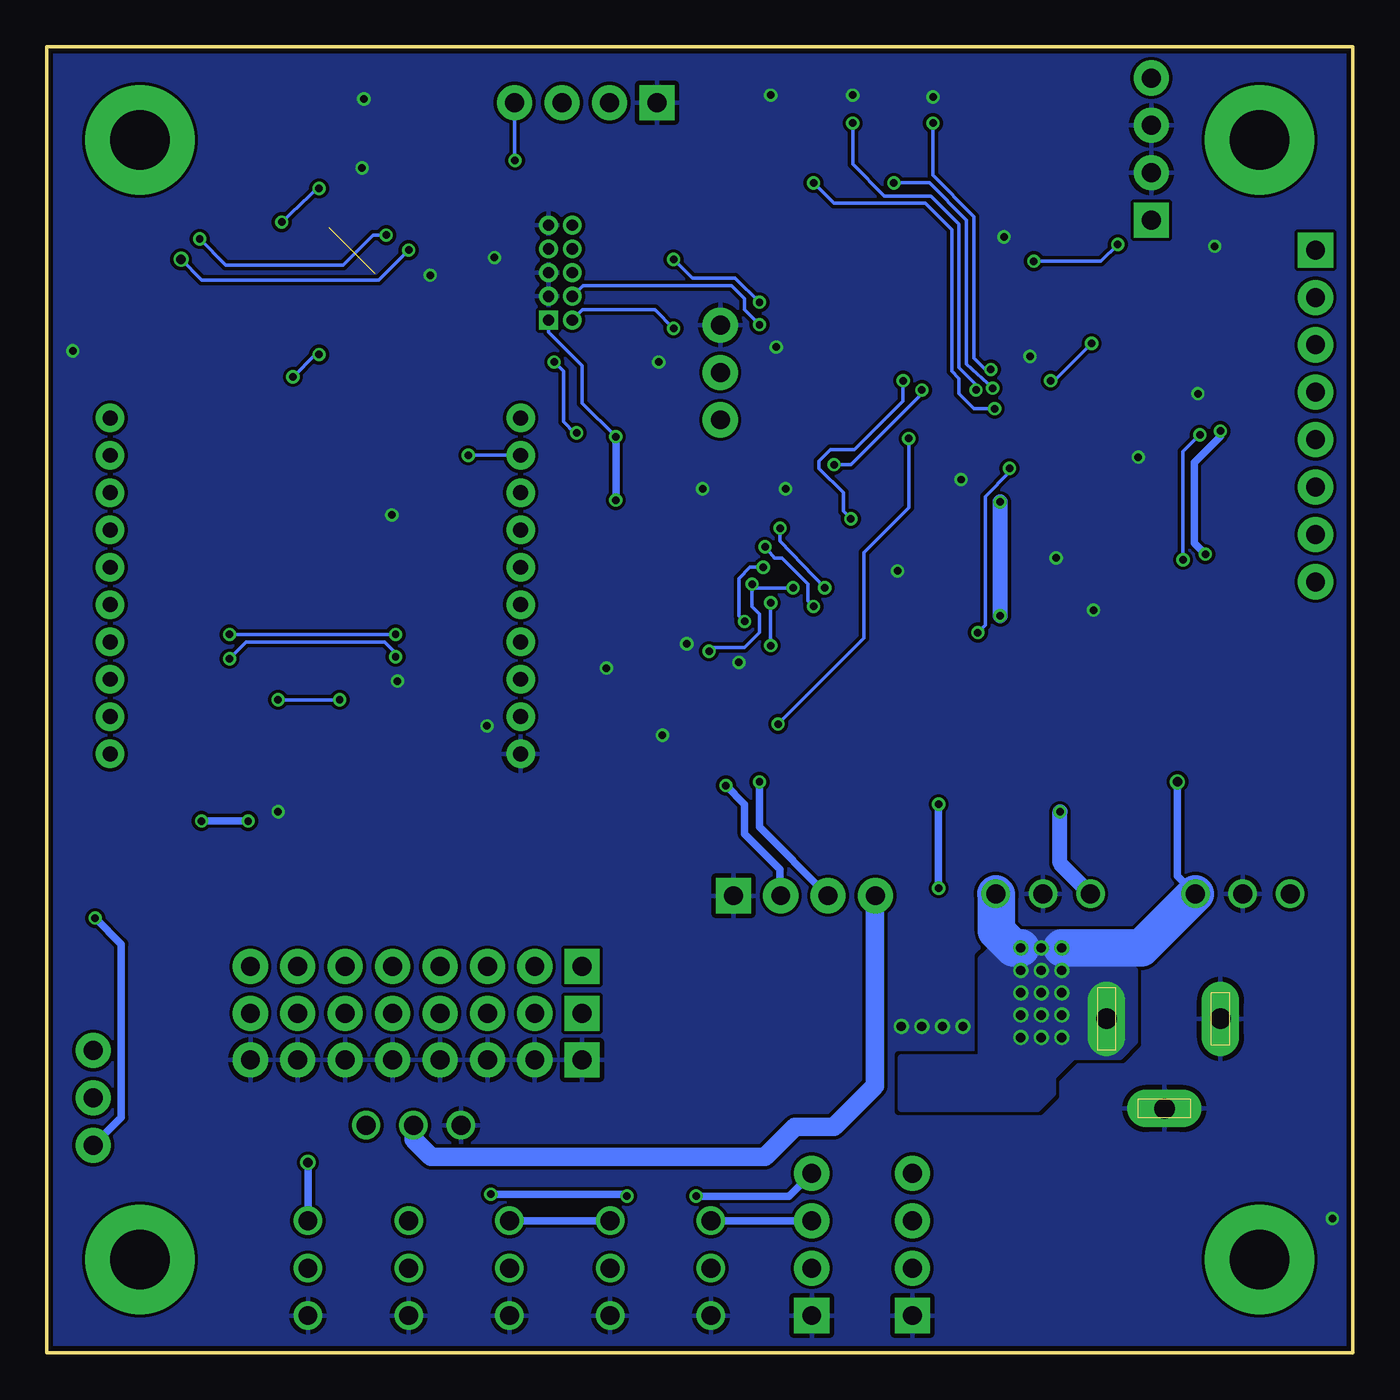
[diagram p8: board, bottom side, seen from below]

Size 70 x 70 mm. Coordinates in mm from the lower left corner, seen from the top.
Outline: 0,0 70,0 70,70 0,70 0,0
Copper layers (1*16): Top 0.035mm / dielectric 1.5mm / Bottom 0.035mm
Design rules "interbotix": minimum track width 7mil, minimum drill 12mil, track to track 7mil, track to pad 7mil, pad to pad 7mil, via to via 7mil, smd to smd 2mil, copper to edge 10mil, drill to drill 7mil, minimum pad ring 8mil, minimum via ring 6mil, stop-mask expansion 2mil, vias tented up to drill 100mil, thermal gap 10mil

### Footprints (pad centres in the part's own frame; a part is rotated, then mirrored left to right if it is on the bottom)
CHIPLED_0603 = smd 0.8 x 0.8: A 0,-0.75; C 0,0.75
BIOLOID = drill 1.016: 1 0,0; 2 2.54,0; 3 5.08,0
OKI-78SRH = drill 1.016: 1 2.54,0; 2 0,0; 3 -2.54,0
1X04 = drill 1.016 pad 1.88 square: 1 0,0 | drill 1.016 pad 1.88: 2 2.54,0; 3 5.08,0; 4 7.62,0
0603-CAP = smd 1.1 x 1: 1 -0.85,0; 2 0.85,0
SV-C = smd 2.54 x 1.27: + -2.223,0; - 2.223,0
DCJ0202 = drill 1.1 pad 2 long: 1 0,3.1; 2 4.8,0; 3 0,-3
SJ_2S-NO = smd 0.635 x 1.27: 1 -0.45,0; 2 0.45,0
3,2-PAD = drill 3.2 pad 5.842: B3,2 0,0
1X08 = drill 1.016 pad 1.88 square: 1 0,0 | drill 1.016 pad 1.88: 2 2.54,0; 3 5.08,0; 4 7.62,0; 5 10.16,0; 6 12.7,0; 7 15.24,0; 8 17.78,0
1X03 = drill 1.016 pad 1.88: 1 0,0; 2 2.54,0; 3 5.08,0
2X5_PTH_SILK_.05 = drill 0.6 pad 1.016 square: 1 0,6.35 | drill 0.6 pad 1.016: 2 1.27,6.35; 3 0,5.08; 4 1.27,5.08; 5 0,3.81; 6 1.27,3.81; 7 0,2.54; 8 1.27,2.54; 9 0,1.27; 10 1.27,1.27
CHIP-LED0603 = smd 0.8 x 0.8: A 0,-0.75; C 0,0.75
4LCC = smd 1.803 x 1.194: 1 -2.032,-1.194; 2 2.032,-1.194; 3 2.032,1.194; 4 -2.032,1.194
TO263 = smd 1 x 3.4: 1 -2.54,-6.6; 2 2.54,-6.6 | smd 6.8 x 9.6: 3 0,3.5
SOT23 = smd 1 x 1.4: 1 -0.95,-1.1; 2 0.95,-1.1; 3 0,1.1
0603-RES = smd 1.1 x 1: 1 -0.85,0; 2 0.85,0
KMR2 = smd 1 x 1: 1 2,0.8; 2 2,-0.8; 3 -2,0.8; 4 -2,-0.8
QFP50P1200X1200X160-64N = smd 1.473 x 0.279: 1 -5.613,3.759; 2 -5.613,3.251; 3 -5.613,2.743; 4 -5.613,2.261; 5 -5.613,1.753; 6 -5.613,1.245; 7 -5.613,0.762; 8 -5.613,0.254; 9 -5.613,-0.254; 10 -5.613,-0.762; 11 -5.613,-1.245; 12 -5.613,-1.753; 13 -5.613,-2.261; 14 -5.613,-2.743; 15 -5.613,-3.251; 16 -5.613,-3.759; 33 5.613,-3.759; 34 5.613,-3.251; 35 5.613,-2.743; 36 5.613,-2.261; 37 5.613,-1.753; 38 5.613,-1.245; 39 5.613,-0.762; 40 5.613,-0.254; 41 5.613,0.254; 42 5.613,0.762; 43 5.613,1.245; 44 5.613,1.753; 45 5.613,2.261; 46 5.613,2.743; 47 5.613,3.251; 48 5.613,3.759 | smd 0.279 x 1.473: 17 -3.759,-5.613; 18 -3.251,-5.613; 19 -2.743,-5.613; 20 -2.261,-5.613; 21 -1.753,-5.613; 22 -1.245,-5.613; 23 -0.762,-5.613; 24 -0.254,-5.613; 25 0.254,-5.613; 26 0.762,-5.613; 27 1.245,-5.613; 28 1.753,-5.613; 29 2.261,-5.613; 30 2.743,-5.613; 31 3.251,-5.613; 32 3.759,-5.613; 49 3.759,5.613; 50 3.251,5.613; 51 2.743,5.613; 52 2.261,5.613; 53 1.753,5.613; 54 1.245,5.613; 55 0.762,5.613; 56 0.254,5.613; 57 -0.254,5.613; 58 -0.762,5.613; 59 -1.245,5.613; 60 -1.753,5.613; 61 -2.261,5.613; 62 -2.743,5.613; 63 -3.251,5.613; 64 -3.759,5.613
SOIC127P600X175-8N = smd 1.981 x 0.533: 1 -2.464,1.905; 2 -2.464,0.635; 3 -2.464,-0.635; 4 -2.464,-1.905; 5 2.464,-1.905; 6 2.464,-0.635; 7 2.464,0.635; 8 2.464,1.905
LGA16-3MM = smd 0.7 x 0.28: 1 -1.4,1; 2 -1.4,0.5; 3 -1.4,0; 4 -1.4,-0.5; 5 -1.4,-1; 9 1.4,-1; 10 1.4,-0.5; 11 1.4,0; 12 1.4,0.5; 13 1.4,1 | smd 0.28 x 0.7: 6 -0.5,-1.4; 7 0,-1.4; 8 0.5,-1.4; 14 0.5,1.4; 15 0,1.4; 16 -0.5,1.4
QFN-32 = smd 0.285 x 0.8: 1 -1.75,-2.5; 2 -1.25,-2.5; 3 -0.75,-2.5; 4 -0.25,-2.5; 5 0.25,-2.5; 6 0.75,-2.5; 7 1.25,-2.5; 8 1.75,-2.5; 17 1.75,2.5; 18 1.25,2.5; 19 0.75,2.5; 20 0.25,2.5; 21 -0.25,2.5; 22 -0.75,2.5; 23 -1.25,2.5; 24 -1.75,2.5 | smd 0.8 x 0.285: 9 2.5,-1.75; 10 2.5,-1.25; 11 2.5,-0.75; 12 2.5,-0.25; 13 2.5,0.25; 14 2.5,0.75; 15 2.5,1.25; 16 2.5,1.75; 25 -2.5,1.75; 26 -2.5,1.25; 27 -2.5,0.75; 28 -2.5,0.25; 29 -2.5,-0.25; 30 -2.5,-0.75; 31 -2.5,-1.25; 32 -2.5,-1.75 | smd 3.15 x 3.15: EP 0,0
14-SOIC = smd 1.016 x 0.508: 1 -2.875,3.81; 2 -2.875,2.54; 3 -2.875,1.27; 4 -2.875,0; 5 -2.875,-1.27; 6 -2.875,-2.54; 7 -2.875,-3.81; 8 2.875,-3.81; 9 2.875,-2.54; 10 2.875,-1.27; 11 2.875,0; 12 2.875,1.27; 13 2.875,2.54; 14 2.875,3.81
XBEE-1 = drill 0.8 pad 1.524: 1 -11,20; 2 -11,18; 3 -11,16; 4 -11,14; 5 -11,12; 6 -11,10; 7 -11,8; 8 -11,6; 9 -11,4; 10 -11,2; 11 11,2; 12 11,4; 13 11,6; 14 11,8; 15 11,10; 16 11,12; 17 11,14; 18 11,16; 19 11,18; 20 11,20
SOT665 = smd 0.3 x 0.99: 1 -0.5,-0.82; 2 0,-0.82; 3 0.5,-0.82; 4 0.5,0.82; 5 -0.5,0.82
B-SMD-5P = smd 0.38 x 1.52: 1 -1.3,2.54; 2 -0.65,2.54; 3 0,2.54; 4 0.65,2.54; 5 1.3,2.54 | smd 1.524 x 1.524: E1 -1.016,-0.381; E2 1.016,-0.381 | smd 1.9 x 1.9: P1 -3.95,-0.381; P2 3.95,-0.381

### Placement (x,y rotation side)
3.3V  12.8,11 270 top
3P1  34.4,2 90 top
3P2  39.8,2 90 top
3P3  45.2,2 90 top
3P4  50.6,2 90 top
3P5  56,2 90 top
3V3REG  16.6,24.6 0 top
4P1  23.6,2 90 top
4P2  29,2 90 top
5V  9.5,11 270 top
5VREG  5.9,24.6 0 top
C1  11.2,46.8 180 top
C2  10.5,53.6 270 top
C3  10.5,56.7 90 top
C4  39.1,35.2 0 top
C5  17.6,12.1 270 top
C6  11.8,4 270 top
C7  39.1,33.1 0 top
C8  35.9,44.6 90 top
C9  17.6,4 270 top
C10  16.8,41.4 180 top
C11  33.8,44.6 90 top
C12  38,44.6 90 top
C13  15.6,56.8 0 top
C14  28.8,53.8 0 top
C15  26.3,41.5 180 top
CPU-POWER  47.8,12.2 0 top
DC1  10.1,17.9 270 top
FTDI-RESET  49.5,62.5 0 top
H1  5,65 0 top
H2  5,5 0 top
H3  65,5 0 top
H4  65,65 0 top
JP1  33.2,24.5 180 top
JP2  41.3,20.7 0 top
JP3  41.3,18.2 0 top
JP4  41.3,15.7 0 top
JP5  2,59.1 270 top
JP6  67.5,16.2 270 top
JP7  33.9,50 90 top
JTAG  43.1,61.7 180 top
LOGO1  39.2,27.1 0 top
MODE  26.8,61.1 90 top
Q1  7.4,55.2 90 top
Q2  29.2,17.1 270 top
Q3  23.9,30.5 180 top
Q4  37.2,50.4 0 top
Q5  13.9,67.5 0 top
R1  29.2,34 90 top
R2  18.7,57.7 270 top
R3  50.7,51.7 270 top
R4  62.9,34.4 270 top
R5  66.1,25.2 180 top
R6  60.8,34.4 270 top
R7  9.5,9.4 0 top
R8  12.8,9.4 0 top
R9  48,51.7 270 top
R10  67.5,20.2 90 top
R11  23.9,35.7 0 top
R12  23.9,33.6 0 top
R13  22.6,22.4 270 top
R14  30.1,48.1 0 top
R15  13.9,64.6 180 top
R16  12.8,41.2 180 top
R17  9.6,41.2 180 top
R18  16.3,61.6 90 top
R19  14.2,61.6 90 top
R20  31.3,62.7 180 top
R21  26.8,62.7 180 top
R22  22.5,62.7 180 top
R23  57.6,11.8 270 top
R24  65.2,59.3 270 top
R25  67.7,59.2 270 top
RESET  31.3,61.1 90 top
RX  19.2,65.5 0 top
SPKR  10.8,60.7 90 top
START  22.5,61.1 90 top
SW1  31.2,66.8 270 top
SW2  22.5,66.8 270 top
SW3  26.8,66.8 270 top
TX  17.7,65.5 0 top
U1  20.5,49.2 0 top
U2  55.6,31.8 0 top
U3  35,40.5 0 top
U4  35,35 270 top
U5  55.4,57.3 45 top
U6  55.6,48.7 0 top
U7  55.6,39.8 0 top
U8  55.6,30.1 0 top
U9  49.7,55.2 180 top
U10  66.1,27.7 180 top
USB-DXL  37.3,67 0 top
USB-MICRO  55.4,66.8 180 top
USBRX  67.7,56.1 0 top
USBTX  65.2,56.1 0 top

### Tracks (layer width: path | path; a pad name or v marks a point on that pad's centre or on a via)
3.3V  (via drill 0.4)
  Top 0.2: C10.1 17.76,41.51 U1.19 17.76,44.46 v18.9,45.6 | C1.1 12.41,46.94 U1.13 17.56,46.94 | C11.1 C8.1 36.75,44.6 38.7,44.6 39,44.3 | C15.1 26.05,42.6 24.5,42.6 24.26,42.84 U1.32 24.26,44.44 24,44.7 19.8,44.7 v18.9,45.6 | U1.1 15.66,52.96 16.1,53.4 | C13.1 15.65,55.9 16.4,55.9 16.74,55.56 U1.64 | 37.2,35 38.05,35 C4.1 38.2,35.2 37.3,36.1 37.3,37.1 37,37.4 36.3,37.4 36,37.1 U4.1 | 37.2,35 U4.15 | U4.14 37,34.5 37.2,34.7 37.2,35 | U3.1 33,41.5 32.8,41.7 32.8,42.75 C11.1 | U3.16 34.5,43.05 | 34.5,43.05 C11.1 | U3.15 35,42.9 34.85,43.05 34.5,43.05 | U5.1 56.3,53.92 56.3,53.7 56.1,53.5 v55.4,53.5 | v18.9,45.6 19.6,46.3 19.6,48.5 18.5,49.6 18.5,52.8 19.1,53.4 20.1,53.4 22.6,50.9 23.9,50.9 25,52 25,52.7 25.26,52.96 U1.48 27.11,52.96 C14.1 | 37.3,32.1 38.3,31.1 40.8,31.1 44.3,27.6 54.2,27.6 56,29.4 56,32.1 56.4,32.5 56.4,52 56.5,52 v56.8,52.3 59.85,55.35 USBTX.A USBRX.A | R8.2 14.9,9.4 15.2,9.1
  Top 0.4: v18.9,45.6 17.56,46.94 17.56,51.94 16.1,53.4 14.75,54.75 C13.1 14.7,56.85 14.7,57.8 16.2,59.3 17.2,59.3 17.8,59.9 17.8,60.7 | 17.8,60.7 17.8,63.7 17.7,63.8 TX.A RX.A | v31.8,30.6 33.3,32.1 37.3,32.1 38.25,33.05 C7.1 C4.1 38.25,42.15 39,42.9 39,44.3 39.5,44.8 v39.5,45.7 | v39.5,49.1 39.3,49.3 Q4.2 | RESET.A 32.05,60.45 31.7,60.1 27.6,60.1 | 27.6,60.1 23.2,60.1 | START.A 23.25,60.15 23.2,60.1 | 23.2,60.1 19.6,60.1 19,60.7 17.8,60.7 | MODE.A 27.55,60.15 27.6,60.1
  Top 0.8: v15.7,29 18.9,32.2 v18.9,39.5
  Top 1: JP3.8 JP3.7 JP3.6 JP3.5 JP3.4 JP3.3 JP3.2 JP3.1 39.8,18.2 39.3,18.7 39.3,21.8 38.3,22.8 29.82,22.8 JP1.3 26.32,26.3 15.76,26.3 3V3REG.3 14.06,24.46 10.5,20.9 10.5,16.1 12.1,14.7 14.2,14.7 15.2,13.7 15.2,9.1 15.2,8.72 16.96,6.96 16.96,6.86 C9.+
  Bottom 0.2: v55.4,53.5 55.6,53.5 v56.8,52.3 | v39.5,49.1 41.3,50.9 41.3,52.9 43.1,54.7 JTAG.1
  Bottom 0.4: JP1.3 31.8,28.18 v31.8,30.6 | v39.5,45.7 v39.5,49.1
  Bottom 0.8: 3V3REG.3 15.7,26.24 v15.7,29 | v18.9,39.5 v18.9,45.6
3V3_XBEE
  Top 0.4: Q4.3 37.8,50.9 42,50.9 42.8,50.1 U8.1
5V  (via drill 0.4)
  Top 0.2: U6.14 58.11,52.51 56.8,51.2 56.8,43.6 | 56.8,43.6 56.8,34.3 57.3,33.8 57.97,33.8 U2.8 60.65,33.7 R6.2 R4.2 | U7.14 56.81,43.61 56.8,43.6 | R5.2 65.2,25.2 61.9,28.5 v61.7,28.5 | R7.2 10.35,7.67 C6.+
  Top 0.4: v33.6,30.4 40.7,30.4 44,27.1 57.8,27.1 v59.2,28.5 | 7.6,33.2 7.6,42.5 v7.9,42.8 | v7.1,49.4 6.6,49.9 6.2,49.9 4.7,51.4 4.7,58.8 6.6,60.7 SPKR.1 | v61.7,28.5 61.7,30.9 60.8,31.8 R6.2
  Top 0.406: 7.6,33.2 7.6,27.7
  Top 1: JP1.2 27.46,27.7 7.6,27.7 6.46,27.7 5VREG.3 3.36,10.34 4.6,9.1 6.7,9.1 9.6,6.2 11.78,6.2 C6.+
  Bottom 0.4: v7.9,42.8 8.5,43.4 8.5,47.7 7.1,49.1 v7.1,49.4 | 30.7,24.54 30.7,25.9 32.6,27.8 32.6,29.4 v33.6,30.4 | v59.2,28.5 v61.7,28.5
  Bottom 0.8: JP1.2 30.7,24.54
485_D+
  Top 0.2: R10.2 66.45,21.05 60.6,26.9 60.6,30.1 59.6,31.1 58.13,31.1 U2.6
  Top 0.4: R10.2 68.25,21.05 68.6,20.7 68.6,17.3 JP6.1
485_D-  (via drill 0.4)
  Top 0.2: U2.7 57.34,32.44 56.6,31.7 56.6,30.8 56.9,30.5 59.6,30.5 60.2,29.9 60.2,26.65 R10.1
  Top 0.4: 4P1.4 4P2.4 | v35.2,8.4 v38.9,8.4 | v46.2,8.5 59.4,8.5 66,15.1 66,17.85 R10.1
  Bottom 0.4: 4P2.4 30.22,8.4 v35.2,8.4 | v38.9,8.4 39,8.5 v46.2,8.5
BOOT0
  Top 0.2: R2.2 18.75,56.8 U1.60
BOOT1
  Top 0.2: U1.28 22.25,41.85 24.3,39.8 27.1,39.8 28.7,38.2 28.7,35.4 29.2,34.9 R1.2
CPU_RXD
  Top 0.2: U1.43 31.8,50.45 JP7.2
CPU_TXD
  Top 0.2: U1.42 33.84,49.96 JP7.1
DATA  (via drill 0.5)
  Top 0.4: 4P1.3 4P2.3 | 3P1.3 3P2.3 | 3P3.3 3P4.3 3P5.3 58.88,7.08 65.4,13.6 67.44,13.6 JP6.2 | R23.2 56.75,10.95 v56,10.2
  Bottom 0.4: 4P2.3 3P1.3 | 3P2.3 3P3.3 | v56,10.2 3P5.3
DXL_RXD
  Top 0.2: U9.5 50.2,53.05 R3.1
DXL_TXD
  Top 0.2: U9.4 49.2,53.45 R9.1 48.05,52.1 49,52.1 49.3,51.8 49.3,46.1 51.2,44.2 53.5,44.2 53.9,43.8 53.9,42.7 53.54,42.34 U7.2
DXLRXD
  Top 0.2: 19.25,55.66 U1.59 19.25,55.85 19.6,56.2 19.6,57.4 21.7,59.5 34.5,59.5 37.5,62.5 44.7,62.5 48.7,58.5 49.8,58.5 50.2,58.1 U9.1
DXLTXD
  Top 0.2: U1.58 19.74,55.74 20,56 20,57.2 21.9,59.1 34.7,59.1 37.7,62.1 44.5,62.1 48.7,57.9 48.7,57.4 49.2,56.9 U9.3
ENABLE_DXLPWR  (via drill 0.4)
  Top 0.2: R11.1 23,35.7 v20.1,38.6 | v18.4,47.4 18.1,47.7 18.1,53.6 18.24,53.74 U1.61
  Bottom 0.2: v20.1,38.6 19.7,39 19.7,45.9 18.4,47.2 v18.4,47.4
ENABLE_RX
  Top 0.2: U1.57 20.25,55.65 20.4,55.8 20.4,57 22.1,58.7 34.9,58.7 37.9,61.7 44.3,61.7 44.9,61.1 44.9,57.7 47.4,55.2 49.5,55.2 49.7,55 49.7,47.3 51.4,45.6 53.9,45.6 54.4,45.1 54.4,42.2 53.9,41.7 52,41.7 51.8,41.5 51.8,40.2 52.2,39.8 U7.4
ENABLE_TX  (via drill 0.4)
  Top 0.2: U1.40 33.05,48.95 33.3,48.7 34.7,48.7 35.4,49.4 35.4,50.1 35.7,50.4 39.2,50.4 40.3,49.3 v41.6,49.3 | 53.1,32.4 U2.2 53.07,32.5 50.1,32.5 | 48.9,43.8 48.9,51.5 48.7,51.7 47.3,51.7 45.9,53.1 v42.8,53.1 | 48.9,43.8 48.9,33.7 50.1,32.5 | 50.1,32.5 51.4,31.2 53.1,31.2 U2.3 | U7.1 49.09,43.61 48.9,43.8
  Bottom 0.2: v41.6,49.3 41.7,49.3 42.3,49.9 42.3,52.6 v42.8,53.1
ENABLE_ZIGBEE
  Top 0.2: U1.39 28.26,48.44 28.6,48.1 R14.1
GND  (via drill 0.4, 0.4 pad 0.7, 0.5)  (2 unrouted)
  Top 0.2: v11.5,48 11.5,47.9 | U1.12 13.75,47.45 13.4,47.8
  other vias: 13.9,39.8 1.1,7.2 15.9,42.6 8.3,51.4 7.4,59.3 30.9,53.9 53.1,63.5 53,67.2 68.6,53.7 24.4,41.9 17.3,53.4 18.7,59.8 35.7,38 32.9,37 37,33.1 34.85,46.3 22.5,67.3 26.8,67.4 31.2,67.4 46,58.7 51.5,44.9 49.45,57.75 46.4,33.6 51.2,36 57.6,29 40,36.7 20.9,17.5 22,17.5 23.1,17.5 24.2,17.5 37.2,53.1 30.4,46.3 21,46.8
  pour Bottom (rank 2): 0,70 70,70 70,0 0,0
  pour Top (rank 2): 0,70 70,70 70,0 0,0
JTCK  (via drill 0.4)
  Top 0.2: U1.49 24.26,55.86 24.7,56.3 30.6,56.3 v31.8,55.1
  Bottom 0.2: v31.8,55.1 32.6,55.9 32.6,56.5 33.3,57.2 41.25,57.2 JTAG.4
JTDI  (via drill 0.4)
  Top 0.2: U1.50 23.75,56.05 24.4,56.7 31.4,56.7 v31.8,56.3 | v36.4,58.6 37.27,59.57 41.42,59.57 JTAG.8
  Bottom 0.2: v36.4,58.6 35.4,57.6 33.1,57.6 v31.8,56.3
JTDO
  Top 0.2: U1.55 21.26,56.66 22.5,57.9 JTAG.6
JTMS  (via drill 0.4)
  Top 0.2: U1.46 31.14,51.94 33,53.8 35.3,53.8 v36.4,54.9
  Bottom 0.2: v36.4,54.9 37.4,55.9 41.28,55.9 JTAG.2
LED2
  Top 0.2: U1.4 13.24,51.46 12.3,52.4 12.3,58.1 13.4,59.2 13.4,59.6 13,60 13,62.9 13.4,63.3 14.1,63.3 14.5,63.7 15.5,63.7 15.7,63.9 15.7,66.7 16.4,67.4 19.4,67.4 20.5,66.3 20.5,64.2 20.8,63.9 31.9,63.9 32.15,63.65 R20.1 32.3,62.7
LED3  (via drill 0.4)
  Top 0.2: 25.4,45.5 25.46,45.44 U1.33 24.36,45.44 v19.2,50.6 | v28.9,62.7 R21.1
  Bottom 0.2: v19.2,50.6 20.3,50.6 21.1,51.4 21.1,52.2 21.5,52.6 21.5,60.2 22.9,61.6 27.8,61.6 v28.9,62.7
LED4  (via drill 0.4)
  Top 0.2: U1.37 25.25,47.45 25.2,47.5 23.3,47.5 19.3,51.5 v19.3,51.7 | R22.1 v24.6,62.7
  Bottom 0.2: v24.6,62.7 22.7,62.7 20.7,60.7 20.7,53 v19.3,51.7
LED_RX
  Top 0.2: U1.3 13.36,51.94 12.7,52.6 12.7,57.9 14.2,59.4 R19.1
LED_TX
  Top 0.2: U1.2 13.55,52.45 13.1,52.9 13.1,57.65 R18.1
N$1
  Top 0.4: R11.2 R12.2 24.75,31.7 Q3.1
N$2
  Top 0.2: U3.14 35.5,42.4 35.9,42.8 37.05,42.8 C12.1
N$3
  Top 0.2: FTDI-RESET.2 49.95,61.45 50.4,61 53.47,61 U5.18
N$5
  Top 0.2: U6.3 51.58,49.97 R3.2
N$6
  Top 0.2: U2.4 51,29.9 48.4,32.5 48.4,49.6 48,50 R9.2
N$7  (via drill 0.4)
  Top 0.2: U6.1 52.99,52.51 55.2,50.3 55.2,35 | 55.2,35 55.2,33.9 55,33.7 53.84,33.7 U2.1 | 55.2,35 v54.3,35 | v57.6,35 59.4,35 59.6,35.2 60.75,35.2 R6.1
  Bottom 0.2: v54.3,35 v57.6,35
N$8
  Top 0.2: R18.2 16.3,63.2 16.5,63.4 16.5,65.9 16.8,66.2 17.7,66.2 TX.C
N$9
  Top 0.4: CPU-POWER.3 55.5,12.2 56,12.7 57.55,12.7 R23.1
N$11
  Top 0.2: R19.2 14.2,62.5 15,63.3 15.8,63.3 16.1,63.6 16.1,66.5 16.6,67 18.45,67 RX.C
N$12
  Top 0.2: R7.1 8.65,10.9 5V.A
N$13
  Top 0.2: R15.2 12.95,64.7 Q5.1
N$14
  Top 0.2: R8.1 11.95,10.9 3.3V.A
N$15  (via drill 0.4)
  Top 0.4: Q3.3 v22.2,29.4
  Top 0.406: v22.2,24.9 23.1,24.9 23.8,24.2 23.8,21.5 | 23.8,21.5 23.8,19.9 23.5,19.6 22.64,19.6 Q2.1 | R13.2 23.75,21.55 23.8,21.5
  Bottom 0.4: v22.2,29.4 v22.2,24.9
N$16
  Top 0.2: SPKR.4 12.38,68.32 13.2,67.5 13.85,67.5 Q5.2
N$17  (via drill 0.4)
  Top 0.2: U7.3 52.76,41.1 54,41.1 54.3,40.8 54.3,38.8 54.03,38.53 U7.5 51.33,38.53 v51.3,38.5 | v60.2,38.5 62.4,38.5 64.2,36.7 64.2,31.6 65.4,30.4 66.2,30.4 66.6,30 U10.1
  Bottom 0.2: v51.3,38.5 v60.2,38.5
N$18
  Top 0.2: Q4.1 35.05,48.1 R14.2
N$19
  Top 0.2: R24.2 USBTX.C
N$20
  Top 0.2: RESET.C 30.55,62.6
  Top 0.4: R20.2 30.55,62.6
N$21
  Top 0.2: MODE.C 26.05,62.6
  Top 0.4: R21.2 26.05,62.6
N$22
  Top 0.2: R25.2 USBRX.C
N$23
  Top 0.2: START.C 21.75,62.6
  Top 0.4: R22.2 21.75,62.6
N$24  (via drill 0.4, 0.5)
  Top 0.2: R24.1 64.35,60.15 v62.8,58.6 | v50.6,59.1 52.54,59.1 U5.22
  Bottom 0.2: v62.8,58.6 61.7,57.5 52.2,57.5 v50.6,59.1
N$25  (via drill 0.4)
  Top 0.2: R25.1 67.25,60.05 66.2,61.1 63.2,61.1 v61.8,59.7 | v51.8,59.9 52.45,59.9 U5.21
  Bottom 0.2: v61.8,59.7 60.4,58.3 54.1,58.3 52.5,59.9 v51.8,59.9
NJTRST
  Top 0.2: U1.56 20.75,55.55 20.8,55.6 20.8,56.8 22.3,58.3 35.1,58.3 37.6,60.8 41.46,60.8 JTAG.10
PC_RXD  (via drill 0.4)
  Top 0.2: U1.30 23.24,42.06 24.7,40.6 27.9,40.6 v28.3,41 | v30.7,44.2 30.7,44.9 33.2,47.4 39.5,47.4 41.6,45.3 41.6,31.5 44.7,28.4 53.8,28.4 55.2,29.8 55.2,32.5 55.6,32.9 55.6,52.3 53.7,54.2 53.7,54.54 U5.30
  Bottom 0.2: v28.3,41 30.7,43.5 v30.7,44.2
PC_TXD  (via drill 0.4)
  Top 0.2: U1.29 22.76,41.94 24.5,40.2 28.7,40.2 v28.9,40 | v31.5,43.2 31.5,45.1 33.4,47 39.3,47 41.2,45.1 41.2,31.3 44.5,28 54,28 55.6,29.6 55.6,32.3 56,32.7 56,52.7 56.8,53.5 56.8,54.13 U5.2
  Bottom 0.2: v28.9,40 29.2,40.3 29.2,41.2 30.6,42.6 31,42.6 v31.5,43.2
PIN_PA8  (via drill 0.4)
  Top 0.2: U1.41 24.25,49.45 v23.8,49 | v30.8,33.7 30.8,30.4 31.6,29.6 38.3,29.6 43,24.9 58.8,24.9 59,24.7 59,20.78 JP2.8
  Bottom 0.2: v23.8,49 23.8,45.3 26.2,42.9 26.2,38.3 v30.8,33.7
RESET  (via drill 0.4)
  Top 0.2: v14,54.1 13.5,54.6 13.5,57.4 15.9,59.8 16.9,59.8 17.3,60.2 17.3,63 16.9,63.4 16.9,65.2 17.2,65.5 19.9,65.5 20.1,65.3 20.1,64 20.6,63.5 31.2,63.5 31.3,63.4 31.3,62 31.5,61.8 33,61.8 33.3,62.1 33.3,64.4 32.9,64.8 SW1.1 SW1.3 | v16.2,52.1 16.2,50.4 15.76,49.96 U1.7
  Bottom 0.2: v16.2,52.1 16,52.1 v14,54.1
RXD_TTL  (via drill 0.4)
  Top 0.2: U6.2 53.56,51.24 54.8,50 54.8,37.8 54.3,37.3 52.77,37.3 U7.6 51.34,37.26 v51.3,37.3 | v60.2,37.2 60.95,37.2 R4.1
  Bottom 0.2: v51.3,37.3 51.3,37.5 51.9,38.1 59.3,38.1 v60.2,37.2
SIG_ACC_CS  (via drill 0.4)
  Top 0.2: U4.8 32.9,34.5 29.9,37.5 29.9,40.1 29.1,40.9 29.1,41.3 26.9,43.5 v26.9,44.7 | U1.51 23.24,52.96 v24.1,52.1
  Bottom 0.2: v24.1,52.1 24.1,51 26.7,48.4 28,48.4 28.6,47.8 28.6,47.4 27.3,46.1 27.3,45.1 v26.9,44.7
SIG_ADC0  (via drill 0.4)
  Top 0.2: U1.8 14.84,49.5 13,49.5 12.5,50 9,50 v8.2,49.2 | R17.1 10.4,41.2 v9.1,42.5
  Top 0.4: R17.1 R16.2
  Bottom 0.2: v9.1,42.5 9.1,48.3 v8.2,49.2
SIG_ADC1
  Top 0.2: JP5.1 4.2,56.9 4.2,51.1 7.3,48 8.8,48 10.4,49.6 12.3,49.6 12.8,49.1 13.9,49.1 14.05,48.95 U1.9
SIG_ADC2
  Top 0.2: U1.10 13.96,48.44 13.7,48.7 12.6,48.7 12.1,49.2 10.6,49.2 9,47.6 7.1,47.6 3.8,50.9 3.8,54.76 JP5.2
SIG_ADC3
  Top 0.2: U1.11 13.85,47.95 13.5,48.3 12.4,48.3 11.9,48.8 10.8,48.8 9.2,47.2 6.9,47.2 3.4,50.7 3.4,52.62 JP5.3
SIG_ADC4
  Top 0.2: U1.14 13.76,46.46 13.2,45.9 7.58,45.9 JP5.4
SIG_ADC5
  Top 0.2: U1.15 13.85,45.95 13.4,45.5 5.44,45.5 JP5.5
SIG_ADC6
  Top 0.2: U1.16 14.04,45.44 13.7,45.1 3.3,45.1 JP5.6
SIG_ADC7
  Top 0.2: U1.17 16.74,44.56 16.6,44.7 2.8,44.7 2,43.9 2.04,43.9 JP5.7
SIG_ADC8
  Top 0.2: U1.20 18.24,42.46 18.6,42.1 18.6,40.7 18.3,40.4 15.1,40.4 14.8,40.7 14.8,42.1 13.2,43.7 7.6,43.7 5.2,41.3 2.02,41.3 JP5.8
SIG_ADC9
  Top 0.2: U1.21 18.75,42.65 19,42.4 19,40.9 22.9,37 25.6,37 25.9,36.7 25.9,31.1 30.2,26.8 36.9,26.8 41.3,22.4 JP2.1
SIG_ADC10
  Top 0.2: U1.22 19.25,42.74 19.4,42.6 19.4,41.1 23.1,37.4 25.8,37.4 26.3,36.9 26.3,31.3 30.4,27.2 37.1,27.2 41.8,22.5 43.6,22.5 43.8,22.3 43.8,20.74 JP2.2
SIG_ADC11
  Top 0.2: U1.23 19.74,42.86 19.8,42.8 19.8,41.3 23.3,37.8 26,37.8 26.7,37.1 26.7,31.5 30.6,27.6 37.3,27.6 42,22.9 46.1,22.9 46.3,22.7 46.3,20.78 JP2.3
SIG_ADC12
  Top 0.2: U1.24 20.25,41.45 23.5,38.2 26.2,38.2 27.1,37.3 27.1,31.7 30.8,28 37.5,28 42.2,23.3 48.7,23.3 48.9,23.1 48.9,20.72 JP2.4
SIG_ADC13
  Top 0.2: U1.25 20.75,41.55 23.7,38.6 26.4,38.6 27.5,37.5 27.5,31.9 31,28.4 37.7,28.4 42.4,23.7 51.2,23.7 51.4,23.5 51.4,20.76 JP2.5
SIG_ADC14
  Top 0.2: U1.26 21.26,41.64 23.9,39 26.7,39 27.9,37.8 27.9,32.1 31.2,28.8 37.9,28.8 42.6,24.1 53.8,24.1 54,23.9 JP2.6
SIG_ADC15
  Top 0.2: U1.27 21.75,41.76 24.1,39.4 26.9,39.4 28.3,38 28.3,32.3 31.4,29.2 38.1,29.2 42.8,24.5 56.2,24.5 56.4,24.3 56.4,20.84 JP2.7
SIG_BUZZER  (via drill 0.4)
  Top 0.2: U1.62 17.76,55.96 17.9,56.1 17.9,57.7 v17.1,58.5 | v12.6,59.4 12.6,63.1 13.2,63.7 13.8,63.7 R15.1
  Bottom 0.2: v17.1,58.5 13.5,58.5 v12.6,59.4
SIG_GYRO_CS  (via drill 0.4)
  Top 0.2: U3.5 32.9,39.5 v32.6,39.2 | v31.6,42.1 31.1,42.1 28.9,44.3 28.9,46.5 v27.8,47.6 | v23.1,51.6 23.1,51.7 22.8,52 22.8,54.77 U1.52
  Bottom 0.2: v32.6,39.2 32.9,39.5 32.9,41.5 32.3,42.1 v31.6,42.1 | v27.8,47.6 26.9,47.6 23.1,51.4 v23.1,51.6
SIG_MISO
  Top 0.2: U4.7 33,35 30.3,37.7 30.3,39.4 30.4,39.4 | U1.35 27.14,46.46 28.1,45.5 28.1,43.9 30.8,41.2 30.8,40.8 30.4,40.4 30.4,39.4 | 30.4,39.4 31.6,39.4 32.2,40 U3.4
SIG_MOSI  (via drill 0.4)
  Top 0.2: U4.6 33.1,35.5 31.2,37.4 v31.2,37.9 | U1.36 27.26,46.94 28.5,45.7 28.5,44.1 31.5,41.1 31.5,40.5 | 31.5,40.5 U3.3 | 31.5,40.5 v31.2,40.2
  Bottom 0.2: v31.2,40.2 v31.2,37.9
SIG_SCK  (via drill 0.4)
  Top 0.2: U1.34 27.05,45.95 27.7,45.3 27.7,43.3 v30,41 | v32.2,41.2 32.4,41 U3.2 | v34.5,37.6 U4.4
  Bottom 0.2: v34.5,37.6 34.3,37.8 32.6,37.8 31.8,38.6 31.8,39.6 32.2,40 v32.2,41.2 32,41 v30,41
SW_MODE  (via drill 0.4)
  Top 0.2: U1.44 25.25,50.95 24.4,50.1 21.5,50.1 20.2,51.4 v20.2,51.6 | v26.8,65.9 27.2,65.9 | 27.2,65.9 27.6,65.5 SW3.1 | 27.2,65.9 27.6,66.3 SW3.3
  Bottom 0.2: v20.2,51.6 20.2,51.9 21.1,52.8 21.1,60.5 22.6,62 25.1,62 26.8,63.7 v26.8,65.9
SW_START  (via drill 0.4)
  Top 0.2: U1.45 25.16,51.46 24.2,50.5 22.3,50.5 20.1,52.7 v19.4,52.7 | v22.5,65.9 23,65.9 | 23,65.9 23.3,65.6 SW2.1 | 23,65.9 23.3,66.2 SW2.3
  Bottom 0.2: v19.4,52.7 19.7,52.7 20.3,53.3 20.3,60.9 22.5,63.1 v22.5,65.9
TTL_DATA  (via drill 0.4)
  Top 0.2: R5.1 66.6,25.55 U10.5
  Top 0.4: v67.4,23.3 67.4,24.75 R5.1
  Bottom 0.4: JP6.3 66,12.62 66,21.9 v67.4,23.3
USBDM
  Top 0.2: U5.15 56.7,60.37 56.7,62.2 56.05,62.85 USB-MICRO.2 56.05,65.05 55.3,65.8 45.8,65.8 45.5,65.5 43.88,65.5 USB-DXL.3
USBDP  (via drill 0.4)
  Top 0.2: v55.4,62.4 USB-MICRO.3 55.4,65.1 55.1,65.4 46,65.4 45.7,65.1 41.74,65.1 USB-DXL.2 | v57.4,60.6 57.4,60.36 U5.14
  Bottom 0.2: v55.4,62.4 55.4,62.5 v57.4,60.6
VBUS  (via drill 0.4)
  Top 0.2: 56.7,65.1 USB-MICRO.1 | v44.9,63.9 46.3,62.5 FTDI-RESET.1 49.05,61.35 49.8,60.6 53.16,60.6 U5.19
  Top 0.4: USB-DXL.4 48,67 50.1,69.1 56.9,69.1 57.8,68.2 57.8,66.2 56.7,65.1
  Bottom 0.2: USB-DXL.4 44.92,63.92 v44.9,63.9
VDD_DXL
  pour Top: 22,6.4 58.8,6.4 58.8,2.7 22,2.7
  pour Top (no thermals): 26.4,20.6 26.4,9.8 29.8,9.8 29.8,6 44.9,6 44.9,7.4 38.5,13.8 38.5,20.9 37.5,21.9 27.7,21.9
VIN  (via drill 0.5)
  Top 0.4: 25.6,24.2 25.6,24.4
  Top 0.406: R17.2 8.75,31.25 v9.4,30.6 | R13.1 20.49,23.25 3V3REG.1
  Top 1: 25.6,24.2 25.6,16.3 24.9,15.6 23.64,15.6 Q2.2 | 25.6,24.4 JP1.4
  Bottom 0.406: v9.4,30.6 9.4,25.56 5VREG.1
  Bottom 1: CPU-POWER.2 50.34,11.44 49.4,10.5 31.5,10.5 29.9,12.1 27.8,12.1 25.6,14.3 25.6,24.48 JP1.4
  Bottom 2: v15.6,21.7 11.34,21.7 5VREG.1 | v17.8,21.7 18.2,21.7 19.1,22.6 19.1,24.56 3V3REG.1
  other vias: 16.7,21.7 17.8,20.5 16.7,20.5 15.6,20.5 15.6,19.3 16.7,19.3 17.8,19.3 17.8,18.1 16.7,18.1 15.6,18.1 15.6,16.9 16.7,16.9 17.8,16.9
  pour Bottom (no thermals): 24.2,13.1 16.9,13.1 16.1,13.9 16.1,14.8 15,15.9 12.5,15.9 11.7,16.7 11.7,20.5 13.7,22.5 18.4,22.5 19.9,21.1 19.9,15.9 20,15.8 24.2,15.8
  pour Top (no thermals): 24.2,13.1 16.9,13.1 16.1,13.9 16.1,14.8 15,15.9 12.5,15.9 11.7,16.7 11.7,20.5 13.7,22.5 18.4,22.5 19.9,21.1 19.9,15.9 20,15.8 24.2,15.8
XTAL1
  Top 0.2: U1.5 12.55,50.95 11.9,51.6 11.9,55.1 11.15,55.85 C3.1 7.15,55.85 6.5,56.5 6.5,56.74 Q1.3
XTAL2
  Top 0.2: U1.6 12.46,50.45 11.5,51.4 11.5,54 11.1,54.4 10.45,54.4 C2.1 9.35,54.45 8.8,53.9 8.8,53.57 Q1.1
ZIGBEE_RXD  (via drill 0.4)
  Top 0.2: U1.54 21.75,56.55 22.7,57.5 35.4,57.5 41,51.9 45.8,51.9 47.2,50.5 47.2,50.1 47.6,49.7 47.6,48.3 v47.4,48.1
  Bottom 0.2: v47.4,48.1 U8.2
ZIGBEE_TXD
  Top 0.2: U1.53 22.25,56.45 22.9,57.1 35.2,57.1 40.8,51.5 45.5,51.5 46.5,50.5 46.5,46.7 45.9,46.1 U8.3

### Text on the board
tNames: JTAG | A1 | GND | A2 | BOOT0 | 2 | 1 | A3 | RX | A4 | TX | A5 | A6 | A7 | A8 | BOOT1 | VIN | 3.3v | 5.0v | GND | Arbotix-Pro / Robocontroller | v1.0 | A9 | A10 | A11 | A12 | A13 | A14 | A13 | PA8 | CPU POWER / ONLY -------> | TTL 485